# Altium project Tray2.PrjPcb (part 1 of 2)
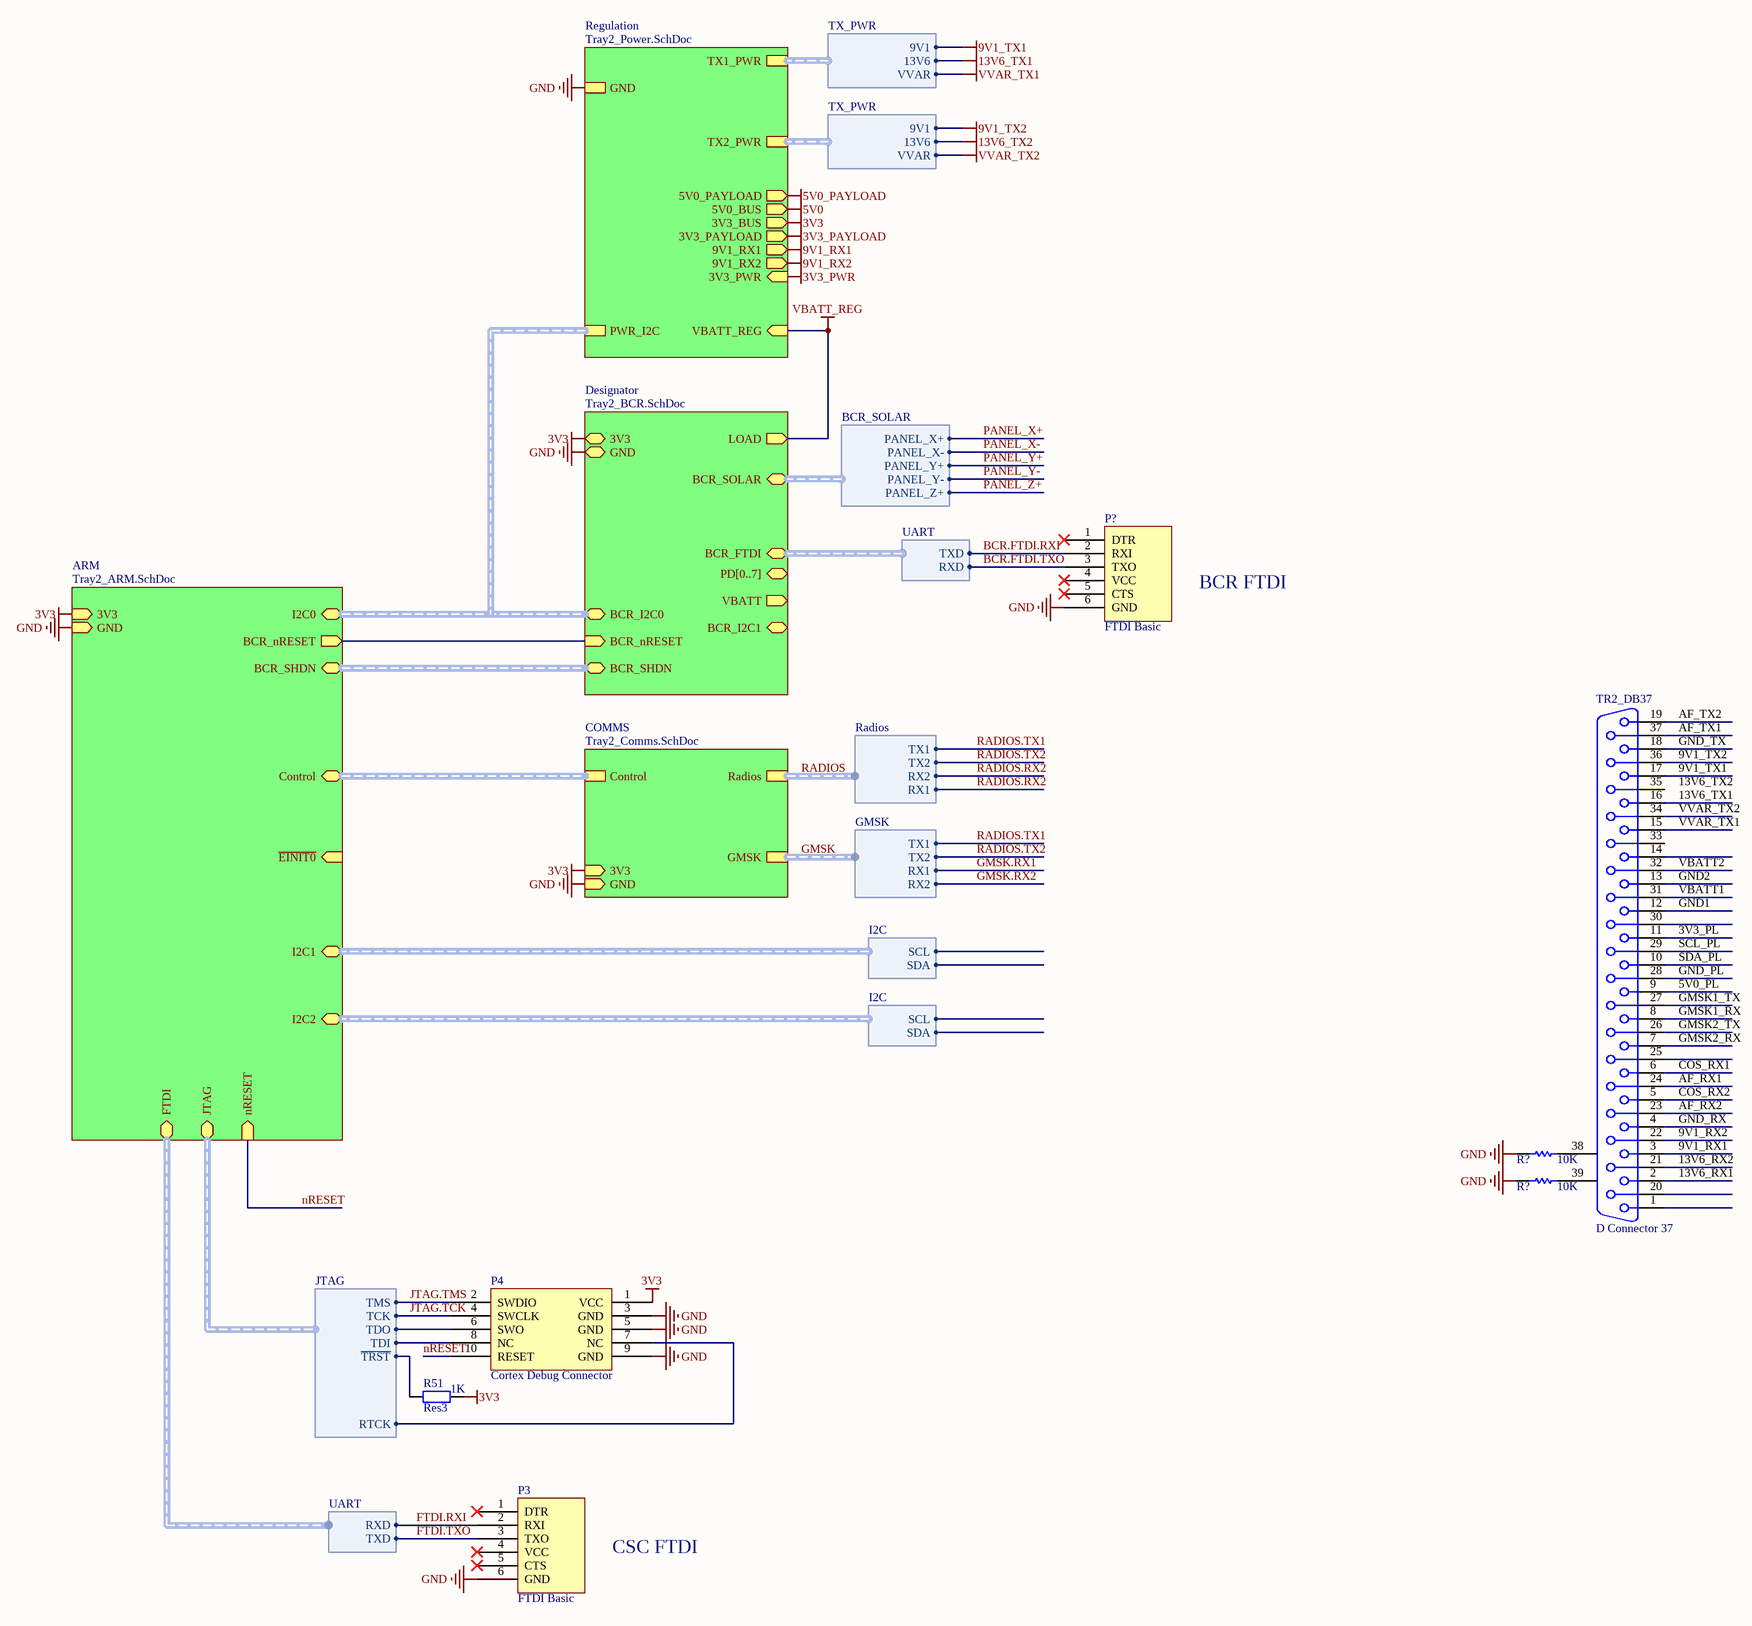
[diagram p0: Tray2_Top.SchDoc]
10 sheets, 509 parts. Net scope: strictly hierarchical (ports join the sheet entries above them; power ports are local).
Board files: Temp_CSC.PcbDoc, Temp_PowerBoard.PcbDoc, Tray2.PcbDoc, Temp_BCR.PcbDoc
Sheets:
  Tray2_Top.SchDoc
    ARM = Tray2_ARM.SchDoc
    Regulation = Tray2_Power.SchDoc
      13V6 = Tray2_Power_RedundantReg.SchDoc
      9V1 = Tray2_Power_RedundantReg.SchDoc
      5V0 = Tray2_Power_RedundantReg.SchDoc
      3V3 = Tray2_Power_RedundantReg.SchDoc
      VVAR = Tray2_Power_RedundantReg.SchDoc
    Designator = Tray2_BCR.SchDoc
      X+ = Tray2_BCR_LT1513.SchDoc
      Y+ = Tray2_BCR_LT1513.SchDoc
      Z+ = Tray2_BCR_LT1513.SchDoc
      X- = Tray2_BCR_LT1513.SchDoc
      Y- = Tray2_BCR_LT1513.SchDoc
    COMMS = Tray2_Comms.SchDoc
      Beacon = Tray2_Comms_Beacon.SchDoc
      SwC = Tray2_Comms_SwC.SchDoc
      AFSK1 = Tray2_Comms_AFSK.SchDoc
      AFSK2 = Tray2_Comms_AFSK.SchDoc

## Sheet Tray2_Top.SchDoc
size A2

### Parts
(Parts that share a designator on the sheet are numbered #1, #2 ... from top to bottom, then left to right.)
P3  FTDI Basic  [FTDI BASIC]
P4  Cortex Debug Connector  [FTSH-105-01-L-DV-TR]
P?  FTDI Basic  [FTDI BASIC]
R51  Res3  value 1K  [RESC1005X06L]
R?#1  value 10K  [RESC2012M]  (hidden comment: Res1)
R?#2  value 10K  [RESC2012M]  (hidden comment: Res1)
TR2_DB37  D Connector 37

### Sub-sheets
ARM = Tray2_ARM.SchDoc: ~{EINIT0} (in), nRESET (in), I2C1 (harness I2C), I2C0 (harness I2C), I2C2 (harness I2C), JTAG (harness JTAG), Control (harness CommsControl), FTDI (harness UART), 3V3 (in), GND (in), BCR_SHDN (harness BCR_SHDN), BCR_nRESET (out)
COMMS = Tray2_Comms.SchDoc: GMSK (harness GMSK), Radios (harness Radios), Control (harness CommsControl), 3V3 (in), GND (in)
Designator = Tray2_BCR.SchDoc: LOAD (out), VBATT (out), 3V3, GND, BCR_nRESET (in), BCR_SOLAR (harness BCR_SOLAR), PD[0..7] (bidir), BCR_I2C0 (harness I2C), BCR_I2C1 (harness I2C), BCR_FTDI (harness UART), BCR_SHDN (harness BCR_SHDN)
Regulation = Tray2_Power.SchDoc: 5V0_BUS (out), 3V3_BUS (out), 5V0_PAYLOAD (out), 3V3_PAYLOAD (out), 9V1_RX1 (out), 9V1_RX2 (out), VBATT_REG (in), GND, 3V3_PWR (in), PWR_I2C (harness I2C), TX1_PWR (harness TX_PWR), TX2_PWR (harness TX_PWR)

### Harnesses
TX_PWR: VVAR, 13V6, 9V1
Radios: RX1, RX2, TX1, TX2
GMSK: RX1, RX2, TX1, TX2
I2C: SCL, SDA
BCR_SOLAR: PANEL_X+, PANEL_X-, PANEL_Y+, PANEL_Y-, PANEL_Z+
JTAG: RTCK, ~{TRST}, TCK, TDI, TDO, TMS
UART: RXD, TXD

### Nets
3V3: P4.1(VCC) R51.2 ; sheet ARM/3V3, sheet Regulation/3V3_BUS, sheet Designator/3V3, sheet COMMS/3V3
9V1_RX1: TR2_DB37.3 ; sheet Regulation/9V1_RX1
9V1_RX2: TR2_DB37.22 ; sheet Regulation/9V1_RX2
9V1_TX1: TR2_DB37.17 ; sheet Regulation/TX1_PWR.9V1
9V1_TX2: TR2_DB37.36 ; sheet Regulation/TX2_PWR.9V1
13V6_TX1: TR2_DB37.16 ; sheet Regulation/TX1_PWR.13V6
GND: P3.6(GND) P4.3(GND) P4.5(GND) P4.9(GND) P?.6(GND) R?#1.1 R?#2.1 ; sheet ARM/GND, sheet Regulation/GND, sheet Designator/GND, sheet COMMS/GND
VBATT_REG: sheet Regulation/VBATT_REG, sheet Designator/LOAD
VVAR_TX1: TR2_DB37.15 ; sheet Regulation/TX1_PWR.VVAR
VVAR_TX2: TR2_DB37.34 ; sheet Regulation/TX2_PWR.VVAR
3V3_PL: TR2_DB37.11
5V0_PL: TR2_DB37.9
13V6_RX1: TR2_DB37.2
13V6_RX2: TR2_DB37.21
AF_RX1: TR2_DB37.24
AF_RX2: TR2_DB37.23
AF_TX1: TR2_DB37.37
AF_TX2: TR2_DB37.19
BCR.FTDI.RXI: P?.2(RXI) ; sheet Designator/BCR_FTDI.TXD
BCR.FTDI.TXO: P?.3(TXO) ; sheet Designator/BCR_FTDI.RXD
BCR_nRESET: sheet ARM/BCR_nRESET, sheet Designator/BCR_nRESET
COS_RX1: TR2_DB37.6
COS_RX2: TR2_DB37.5
FTDI.RXI: P3.2(RXI) ; sheet ARM/FTDI.RXD
FTDI.TXO: P3.3(TXO) ; sheet ARM/FTDI.TXD
GMSK1_RX: TR2_DB37.8
GMSK1_TX: TR2_DB37.27
GMSK2_RX: TR2_DB37.7
GMSK2_TX: TR2_DB37.26
GMSK.RX1: sheet COMMS/GMSK.RX1
GMSK.RX2: sheet COMMS/GMSK.RX2
GND1: TR2_DB37.12
GND2: TR2_DB37.13
GND_PL: TR2_DB37.28
GND_RX: TR2_DB37.4
GND_TX: TR2_DB37.18
JTAG.TCK: P4.4(SWCLK) ; sheet ARM/JTAG.TCK
JTAG.TMS: P4.2(SWDIO) ; sheet ARM/JTAG.TMS
nRESET: P4.10(RESET) ; sheet ARM/nRESET
RADIOS.RX2: sheet COMMS/Radios.RX1, sheet COMMS/Radios.RX2  [project net RADIOS.RX1]
RADIOS.TX1: sheet COMMS/Radios.TX1, sheet COMMS/GMSK.TX1  [project net GMSK.TX1]
RADIOS.TX2: sheet COMMS/Radios.TX2, sheet COMMS/GMSK.TX2  [project net GMSK.TX2]
SCL_PL: TR2_DB37.29
SDA_PL: TR2_DB37.10
VBATT1: TR2_DB37.31
VBATT2: TR2_DB37.32
NetP4_6: P4.6(SWO) ; sheet ARM/JTAG.TDO
NetP4_7: P4.7(NC) ; sheet ARM/JTAG.RTCK
NetP4_8: P4.8(NC) ; sheet ARM/JTAG.TDI
NetR51_1: R51.1 ; sheet ARM/JTAG.~{TRST}
NetR?#1_2: R?#1.2 TR2_DB37.38(MH1)
NetR?#2_2: R?#2.2 TR2_DB37.39(MH2)

Not connected (* = marked no-connect by the designer): P3 1(DTR)* 4(VCC)* 5(CTS)*; P? 1(DTR)* 4(VCC)* 5(CTS)*; TR2_DB37 1 14 20 25 30 33 35

### Buses and harness runs
harness GMSK = sheet COMMS/GMSK
harness RADIOS = sheet COMMS/Radios
harness sheet ARM/BCR_SHDN = sheet Designator/BCR_SHDN
harness sheet ARM/Control = sheet COMMS/Control
harness sheet ARM/I2C0 = sheet Designator/BCR_I2C0 = sheet Regulation/PWR_I2C

### Notes on the sheet
- BCR FTDI
- CSC FTDI
- Labels drawn without touching a wire or pin: 13V6_TX2

### Library data of the parts
P4 = Cortex Debug Connector: Mates with FFSD-05-D-12.00-01-N
R51 = Res3: Resistor; Published: 8-Jun-2000; LatestRevisionDate: 29-May-2009; LatestRevisionNote: IPC-7351 Footprint Added.; PackageReference: J1-0603; Publisher: Altium Limited; PackageDescription: Chip Resistor
R?#1 R?#2 = Res1: Resistor; Published: 8-Jun-2000; LatestRevisionDate: 17-Jul-2002; LatestRevisionNote: Re-released for DXP Platform.; PackageReference: AXIAL-0.3; Publisher: Altium Limited; PackageDescription: Axial Device, Thru-Hole; 2 Leads; 0.3 in Pin Spacing; Supplier 1: Farnell
TR2_DB37 = D Connector 37: Receptacle Assembly, 37 Position, Right Angle; PackageDocument: U; Positions: 25; Published: 15-Jun-2001; LatestRevisionDate: 17-Jul-2002; LatestRevisionNote: Re-released for DXP Platform.; DatasheetDocument: 19-Mar-1999; PackageReference: 787202; Publisher: Altium Limited; Orientation: Right Angle; Gender: Receptacle

## Sheet Tray2_ARM.SchDoc
size A3; PageSetup: Record=PageOptions|CenterHorizontal=True|CenterVertical=True|PrintScale=0.97|XCorrection=1.00|YCorrection=1.00|PrintKind=1|BorderSize=5000000|LeftOffset=0|BottomOffset=0|Orientation=2|PaperLength=2970|PaperWidth=2100|Scale=100|PaperSource=7|PrintQuality=1200|MediaType=1|DitherType=10|PaperKind=A4|PrintScaleMode=1
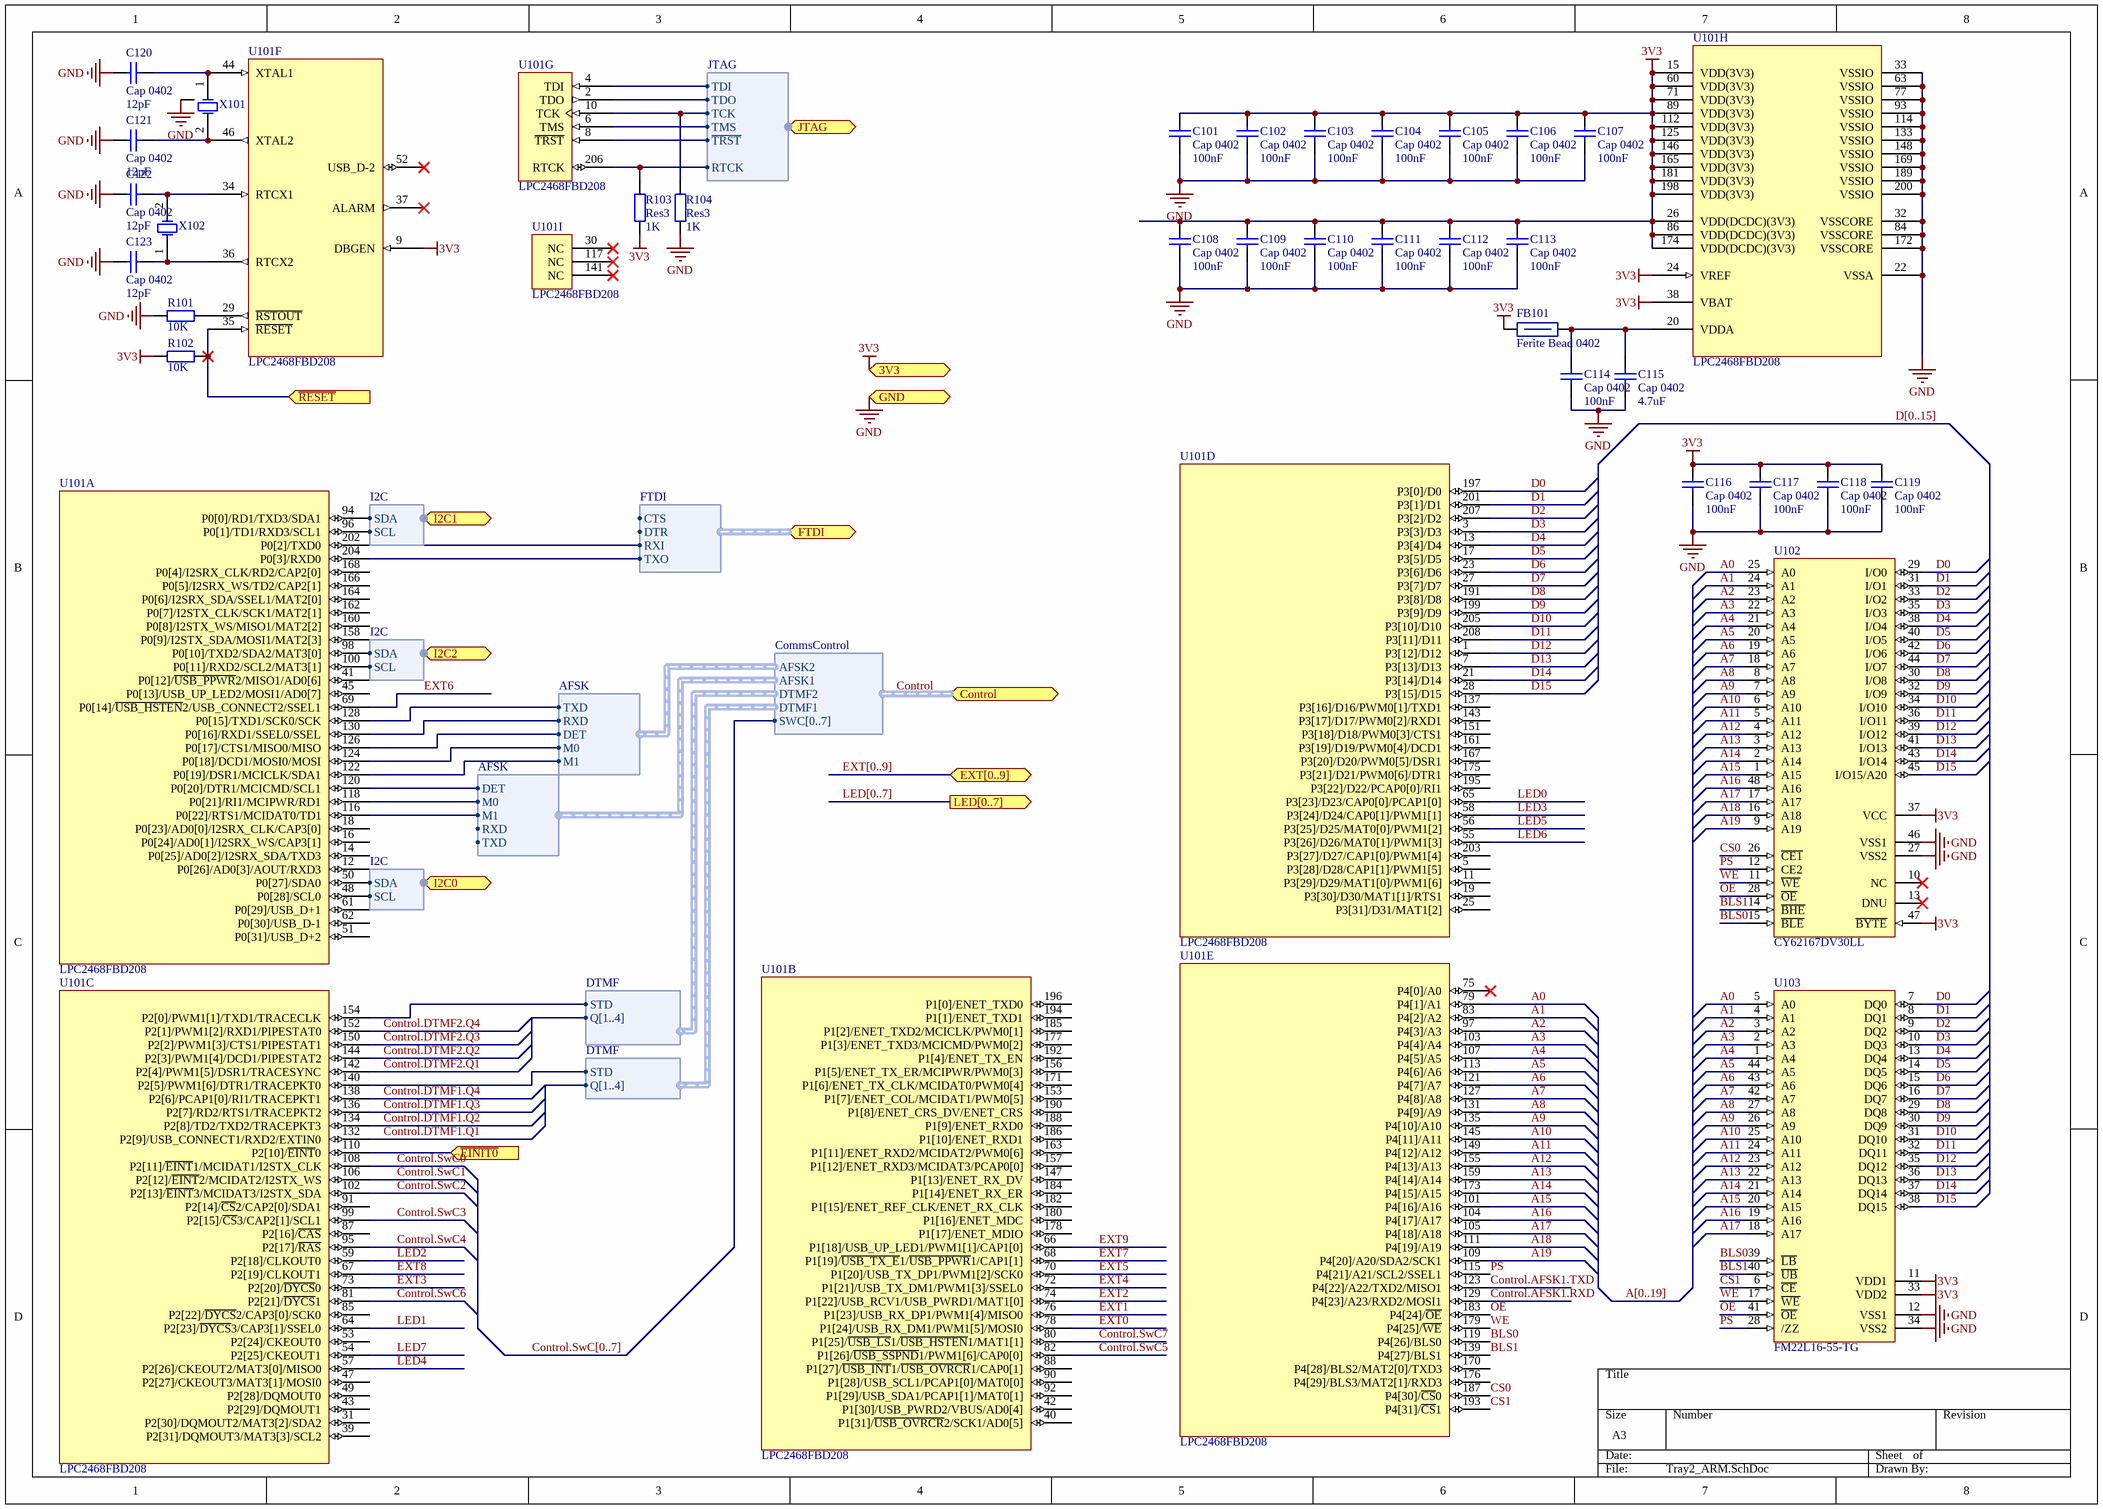
[diagram p1: Tray2_ARM.SchDoc]

### Parts
C101  Cap 0402  value 100nF  [CAPC1005X06L]
C102  Cap 0402  value 100nF  [CAPC1005X06L]
C103  Cap 0402  value 100nF  [CAPC1005X06L]
C104  Cap 0402  value 100nF  [CAPC1005X06L]
C105  Cap 0402  value 100nF  [CAPC1005X06L]
C106  Cap 0402  value 100nF  [CAPC1005X06L]
C107  Cap 0402  value 100nF  [CAPC1005X06L]
C108  Cap 0402  value 100nF  [CAPC1005X06L]
C109  Cap 0402  value 100nF  [CAPC1005X06L]
C110  Cap 0402  value 100nF  [CAPC1005X06L]
C111  Cap 0402  value 100nF  [CAPC1005X06L]
C112  Cap 0402  value 100nF  [CAPC1005X06L]
C113  Cap 0402  value 100nF  [CAPC1005X06L]
C114  Cap 0402  value 100nF  [CAPC1005X06L]
C115  Cap 0402  value 4.7uF  [CAPC1005X06L]
C116  Cap 0402  value 100nF  [CAPC1005X06L]
C117  Cap 0402  value 100nF  [CAPC1005X06L]
C118  Cap 0402  value 100nF  [CAPC1005X06L]
C119  Cap 0402  value 100nF  [CAPC1005X06L]
C120  Cap 0402  value 12pF  [CAPC1005X06L]
C121  Cap 0402  value 12pF  [CAPC1005X06L]
C122  Cap 0402  value 12pF  [CAPC1005X06L]
C123  Cap 0402  value 12pF  [CAPC1005X06L]
FB101  Ferite Bead 0402  [INDC1005X06L]
R101  value 10K  [RESC1005X06L]  (hidden comment: Res3)
R102  value 10K  [RESC1005X06L]  (hidden comment: Res3)
R103  Res3  value 1K  [RESC1005X06L]
R104  Res3  value 1K  [RESC1005X06L]
U101  LPC2468FBD208  [TSQFP50P3000X3000X160-208L]  (parts A,B,C,D,E,F,G,H,I of 9)
U102  CY62167DV30LL  [TSSOP50P2000X120-48L]
U103  FM22L16-55-TG  [TSOP80P1180X120-44L]
X101  Crystal Oscilator  [7M]  (value not drawn)
X102  Crystal Oscilator  [9H T10]  (value not drawn)

### Ports
3V3 (in), Control (harness CommsControl), EXT[0..9] (bidir), FTDI (harness FTDI), GND (in), I2C0 (harness I2C), I2C1 (harness I2C), I2C2 (harness I2C), JTAG (harness JTAG), LED[0..7] (out), ~{EINIT0} (in), ~{RESET} (in)

### Harnesses
I2C: SDA, SCL
JTAG: TDI, TDO, TCK, TMS, ~{TRST}, RTCK
AFSK: DET, M0, M1, RXD, TXD
DTMF: Q[1..4], STD
CommsControl: AFSK1, AFSK2, DTMF1, DTMF2, SWC[0..7]
FTDI: CTS, DTR, RXI, TXO

### Nets
3V3: C101.2 C102.2 C103.2 C104.2 C105.2 C106.2 C107.2 C108.2 C109.2 C110.2 C111.2 C112.2 C113.2 C116.2 C117.2 C118.2 C119.2 FB101.1 R102.2 R103.2 U101.9(DBGEN) U101.15(VDD(3V3)) U101.24(VREF) U101.26(VDD(DCDC)(3V3)) U101.38(VBAT) U101.60(VDD(3V3)) U101.71(VDD(3V3)) U101.86(VDD(DCDC)(3V3)) U101.89(VDD(3V3)) U101.112(VDD(3V3)) U101.125(VDD(3V3)) U101.146(VDD(3V3)) U101.165(VDD(3V3)) U101.174(VDD(DCDC)(3V3)) U101.181(VDD(3V3)) U101.198(VDD(3V3)) U102.37(VCC) U102.47(~{BYTE}) U103.11(VDD1) U103.33(VDD2) ; port 3V3
GND: C101.1 C102.1 C103.1 C104.1 C105.1 C106.1 C107.1 C108.1 C109.1 C110.1 C111.1 C112.1 C113.1 C114.1 C115.1 C116.1 C117.1 C118.1 C119.1 C120.2 C121.1 C122.2 C123.1 R101.2 R104.2 U101.22(VSSA) U101.32(VSSCORE) U101.33(VSSIO) U101.63(VSSIO) U101.77(VSSIO) U101.84(VSSCORE) U101.93(VSSIO) U101.114(VSSIO) U101.133(VSSIO) U101.148(VSSIO) U101.169(VSSIO) U101.172(VSSCORE) U101.189(VSSIO) U101.200(VSSIO) U102.27(VSS2) U102.46(VSS1) U103.12(VSS1) U103.34(VSS2) X101.3 ; port GND
A0: U101.79(P4[1]/A1) U102.25(A0) U103.5(A0)
A1: U101.83(P4[2]/A2) U102.24(A1) U103.4(A1)
A2: U101.97(P4[3]/A3) U102.23(A2) U103.3(A2)
A3: U101.103(P4[4]/A4) U102.22(A3) U103.2(A3)
A4: U101.107(P4[5]/A5) U102.21(A4) U103.1(A4)
A5: U101.113(P4[6]/A6) U102.20(A5) U103.44(A5)
A6: U101.121(P4[7]/A7) U102.19(A6) U103.43(A6)
A7: U101.127(P4[8]/A8) U102.18(A7) U103.42(A7)
A8: U101.131(P4[9]/A9) U102.8(A8) U103.27(A8)
A9: U101.135(P4[10]/A10) U102.7(A9) U103.26(A9)
A10: U101.145(P4[11]/A11) U102.6(A10) U103.25(A10)
A11: U101.149(P4[12]/A12) U102.5(A11) U103.24(A11)
A12: U101.155(P4[13]/A13) U102.4(A12) U103.23(A12)
A13: U101.159(P4[14]/A14) U102.3(A13) U103.22(A13)
A14: U101.173(P4[15]/A15) U102.2(A14) U103.21(A14)
A15: U101.101(P4[16]/A16) U102.1(A15) U103.20(A15)
A16: U101.104(P4[17]/A17) U102.48(A16) U103.19(A16)
A17: U101.105(P4[18]/A18) U102.17(A17) U103.18(A17)
A18: U101.111(P4[19]/A19) U102.16(A18)
A19: U101.109(P4[20]/A20/SDA2/SCK1) U102.9(A19)
BLS0: U101.119(P4[26]/BLS0) U102.15(~{BLE}) U103.39(~{LB})
BLS1: U101.139(P4[27]/BLS1) U102.14(~{BHE}) U103.40(~{UB})
Control.AFSK1.RXD: U101.129(P4[23]/A23/RXD2/MOSI1)
Control.AFSK1.TXD: U101.123(P4[22]/A22/TXD2/MISO1)
Control.DTMF1.Q1: U101.132(P2[9]/USB_CONNECT1/RXD2/EXTIN0)
Control.DTMF1.Q2: U101.134(P2[8]/TD2/TXD2/TRACEPKT3)
Control.DTMF1.Q3: U101.136(P2[7]/RD2/RTS1/TRACEPKT2)
Control.DTMF1.Q4: U101.138(P2[6]/PCAP1[0]/RI1/TRACEPKT1)
Control.DTMF2.Q1: U101.142(P2[4]/PWM1[5]/DSR1/TRACESYNC)
Control.DTMF2.Q2: U101.144(P2[3]/PWM1[4]/DCD1/PIPESTAT2)
Control.DTMF2.Q3: U101.150(P2[2]/PWM1[3]/CTS1/PIPESTAT1)
Control.DTMF2.Q4: U101.152(P2[1]/PWM1[2]/RXD1/PIPESTAT0)
Control.SwC0: U101.108(P2[11]/~{EINT}1/MCIDAT1/I2STX_CLK)
Control.SwC1: U101.106(P2[12]/~{EINT}2/MCIDAT2/I2STX_WS)
Control.SwC2: U101.102(P2[13]/~{EINT}3/MCIDAT3/I2STX_SDA)
Control.SwC3: U101.99(P2[15]/~{CS}3/CAP2[1]/SCL1)
Control.SwC4: U101.95(P2[17]/~{RAS})
Control.SwC5: U101.82(P1[26]/~{USB_SSPND}1/PWM1[6]/CAP0[0])
Control.SwC6: U101.81(P2[21]/~{DYCS}1)
Control.SwC7: U101.80(P1[25]/~{USB_LS}1/~{USB_HSTEN}1/MAT1[1])
CS0: U101.187(P4[30]/~{CS}0) U102.26(~{CE1})
CS1: U101.193(P4[31]/~{CS}1) U103.6(~{CE})
D0: U101.197(P3[0]/D0) U102.29(I/O0) U103.7(DQ0)
D1: U101.201(P3[1]/D1) U102.31(I/O1) U103.8(DQ1)
D2: U101.207(P3[2]/D2) U102.33(I/O2) U103.9(DQ2)
D3: U101.3(P3[3]/D3) U102.35(I/O3) U103.10(DQ3)
D4: U101.13(P3[4]/D4) U102.38(I/O4) U103.13(DQ4)
D5: U101.17(P3[5]/D5) U102.40(I/O5) U103.14(DQ5)
D6: U101.23(P3[6]/D6) U102.42(I/O6) U103.15(DQ6)
D7: U101.27(P3[7]/D7) U102.44(I/O7) U103.16(DQ7)
D8: U101.191(P3[8]/D8) U102.30(I/O8) U103.29(DQ8)
D9: U101.199(P3[9]/D9) U102.32(I/O9) U103.30(DQ9)
D10: U101.205(P3[10]/D10) U102.34(I/O10) U103.31(DQ10)
D11: U101.208(P3[11]/D11) U102.36(I/O11) U103.32(DQ11)
D12: U101.1(P3[12]/D12) U102.39(I/O12) U103.35(DQ12)
D13: U101.7(P3[13]/D13) U102.41(I/O13) U103.36(DQ13)
D14: U101.21(P3[14]/D14) U102.43(I/O14) U103.37(DQ14)
D15: U101.28(P3[15]/D15) U102.45(I/O15/A20) U103.38(DQ15)
EXT0: U101.78(P1[24]/USB_RX_DM1/PWM1[5]/MOSI0)
EXT1: U101.76(P1[23]/USB_RX_DP1/PWM1[4]/MISO0)
EXT2: U101.74(P1[22]/USB_RCV1/USB_PWRD1/MAT1[0])
EXT3: U101.73(P2[20]/~{DYCS}0)
EXT4: U101.72(P1[21]/USB_TX_DM1/PWM1[3]/SSEL0)
EXT5: U101.70(P1[20]/USB_TX_DP1/PWM1[2]/SCK0)
EXT6: U101.69(P0[14]/~{USB_HSTEN}2/USB_CONNECT2/SSEL1)
EXT7: U101.68(P1[19]/~{USB_TX_E}1/~{USB_PPWR}1/CAP1[1])
EXT8: U101.67(P2[19]/CLKOUT1)
EXT9: U101.66(P1[18]/USB_UP_LED1/PWM1[1]/CAP1[0])
JTAG.TCK: R104.1 U101.10(TCK) ; port JTAG.TCK
JTAG.TMS: U101.6(TMS) ; port JTAG.TMS
LED0: U101.65(P3[23]/D23/CAP0[0]/PCAP1[0])
LED1: U101.64(P2[23]/~{DYCS}3/CAP3[1]/SSEL0)
LED2: U101.59(P2[18]/CLKOUT0)
LED3: U101.58(P3[24]/D24/CAP0[1]/PWM1[1])
LED4: U101.57(P2[26]/CKEOUT2/MAT3[0]/MISO0)
LED5: U101.56(P3[25]/D25/MAT0[0]/PWM1[2])
LED6: U101.55(P3[26]/D26/MAT0[1]/PWM1[3])
LED7: U101.54(P2[25]/CKEOUT1)
OE: U101.183(P4[24]/~{OE}) U102.28(~{OE}) U103.41(~{OE})
PS: U101.115(P4[21]/A21/SCL2/SSEL1) U102.12(CE2) U103.28(/ZZ)
SCL: U101.48(P0[28]/SCL0) ; port I2C0.SCL
SDA: U101.50(P0[27]/SDA0) ; port I2C0.SDA
WE: U101.179(P4[25]/~{WE}) U102.11(~{WE}) U103.17(~{WE})
NetC114_2: C114.2 C115.2 FB101.2 U101.20(VDDA)
NetC120_1: C120.1 U101.44(XTAL1) X101.1(OSC1)
NetC121_2: C121.2 U101.46(XTAL2) X101.2(OSC2)
NetC122_1: C122.1 U101.34(RTCX1) X102.2(OSC2)
NetC123_2: C123.2 U101.36(RTCX2) X102.1(OSC1)
NetP4_6: U101.2(TDO) ; port JTAG.TDO
NetP4_7: R103.1 U101.206(RTCK) ; port JTAG.RTCK
NetP4_8: U101.4(TDI) ; port JTAG.TDI
NetR51_1: U101.8(~{TRST}) ; port JTAG.~{TRST}
NetR101_1: R101.1 U101.29(~{RSTOUT})
NetR102_1: R102.1 U101.35(~{RESET}) ; port ~{RESET}
NetU101_94: U101.94(P0[0]/RD1/TXD3/SDA1) ; port I2C1.SDA
NetU101_96: U101.96(P0[1]/TD1/RXD3/SCL1) ; port I2C1.SCL
NetU101_98: U101.98(P0[10]/TXD2/SDA2/MAT3[0]) ; port I2C2.SDA
NetU101_100: U101.100(P0[11]/RXD2/SCL2/MAT3[1]) ; port I2C2.SCL
NetU101_110: U101.110(P2[10]/~{EINT}0) ; port ~{EINIT0}
NetU101_116: U101.116(P0[22]/RTS1/MCIDAT0/TD1) ; harness AFSK.M1
NetU101_118: U101.118(P0[21]/RI1/MCIPWR/RD1) ; harness AFSK.M0
NetU101_120: U101.120(P0[20]/DTR1/MCICMD/SCL1) ; harness AFSK.DET
NetU101_122: U101.122(P0[19]/DSR1/MCICLK/SDA1) ; harness AFSK.M1
NetU101_124: U101.124(P0[18]/DCD1/MOSI0/MOSI) ; harness AFSK.M0
NetU101_126: U101.126(P0[17]/CTS1/MISO0/MISO) ; harness AFSK.DET
NetU101_128: U101.128(P0[15]/TXD1/SCK0/SCK) ; harness AFSK.TXD
NetU101_130: U101.130(P0[16]/RXD1/SSEL0/SSEL) ; harness AFSK.RXD
NetU101_140: U101.140(P2[5]/PWM1[6]/DTR1/TRACEPKT0) ; harness DTMF.STD
NetU101_154: U101.154(P2[0]/PWM1[1]/TXD1/TRACECLK) ; harness DTMF.STD
NetU101_202: U101.202(P0[2]/TXD0) ; port FTDI.RXI
NetU101_204: U101.204(P0[3]/RXD0) ; port FTDI.TXO

Not connected (* = marked no-connect by the designer): U101 5(P3[28]/D28/CAP1[1]/PWM1[5]) 11(P3[29]/D29/MAT1[0]/PWM1[6]) 12(P0[26]/AD0[3]/AOUT/RXD3) 14(P0[25]/AD0[2]/I2SRX_SDA/TXD3) 16(P0[24]/AD0[1]/I2SRX_WS/CAP3[1]) 18(P0[23]/AD0[0]/I2SRX_CLK/CAP3[0]) 19(P3[30]/D30/MAT1[1]/RTS1) 25(P3[31]/D31/MAT1[2]) 30(NC)* 31(P2[30]/DQMOUT2/MAT3[2]/SDA2) 37(ALARM)* 39(P2[31]/DQMOUT3/MAT3[3]/SCL2) 40(P1[31]/~{USB_OVRCR}2/SCK1/AD0[5]) 41(P0[12]/~{USB_PPWR}2/MISO1/AD0[6]) 42(P1[30]/USB_PWRD2/VBUS/AD0[4]) 43(P2[29]/DQMOUT1) 45(P0[13]/USB_UP_LED2/MOSI1/AD0[7]) 47(P2[27]/CKEOUT3/MAT3[1]/MOSI0) 49(P2[28]/DQMOUT0) 51(P0[31]/USB_D+2) 52(USB_D-2)* 53(P2[24]/CKEOUT0) 61(P0[29]/USB_D+1) 62(P0[30]/USB_D-1) 75(P4[0]/A0)* 85(P2[22]/~{DYCS}2/CAP3[0]/SCK0) 87(P2[16]/~{CAS}) 88(P1[27]/~{USB_INT}1/~{USB_OVRCR}1/CAP0[1]) 90(P1[28]/USB_SCL1/PCAP1[0]/MAT0[0]) 91(P2[14]/~{CS}2/CAP2[0]/SDA1) 92(P1[29]/USB_SDA1/PCAP1[1]/MAT0[1]) 117(NC)* 137(P3[16]/D16/PWM0[1]/TXD1) 141(NC)* 143(P3[17]/D17/PWM0[2]/RXD1) 147(P1[13]/ENET_RX_DV) 151(P3[18]/D18/PWM0[3]/CTS1) 153(P1[7]/ENET_COL/MCIDAT1/PWM0[5]) 156(P1[5]/ENET_TX_ER/MCIPWR/PWM0[3]) 157(P1[12]/ENET_RXD3/MCIDAT3/PCAP0[0]) 158(P0[9]/I2STX_SDA/MOSI1/MAT2[3]) 160(P0[8]/I2STX_WS/MISO1/MAT2[2]) 161(P3[19]/D19/PWM0[4]/DCD1) 162(P0[7]/I2STX_CLK/SCK1/MAT2[1]) 163(P1[11]/ENET_RXD2/MCIDAT2/PWM0[6]) 164(P0[6]/I2SRX_SDA/SSEL1/MAT2[0]) 166(P0[5]/I2SRX_WS/TD2/CAP2[1]) 167(P3[20]/D20/PWM0[5]/DSR1) 168(P0[4]/I2SRX_CLK/RD2/CAP2[0]) 170(P4[28]/BLS2/MAT2[0]/TXD3) 171(P1[6]/ENET_TX_CLK/MCIDAT0/PWM0[4]) 175(P3[21]/D21/PWM0[6]/DTR1) 176(P4[29]/BLS3/MAT2[1]/RXD3) 177(P1[3]/ENET_TXD3/MCICMD/PWM0[2]) 178(P1[17]/ENET_MDIO) 180(P1[16]/ENET_MDC) 182(P1[15]/ENET_REF_CLK/ENET_RX_CLK) 184(P1[14]/ENET_RX_ER) 185(P1[2]/ENET_TXD2/MCICLK/PWM0[1]) 186(P1[10]/ENET_RXD1) 188(P1[9]/ENET_RXD0) 190(P1[8]/ENET_CRS_DV/ENET_CRS) 192(P1[4]/ENET_TX_EN) 194(P1[1]/ENET_TXD1) 195(P3[22]/D22/PCAP0[0]/RI1) 196(P1[0]/ENET_TXD0) 203(P3[27]/D27/CAP1[0]/PWM1[4]); U102 10(NC)* 13(DNU)*

### Buses and harness runs
bus A[0..19]
bus Control.SwC[0..7]
bus D[0..15]
bus EXT[0..9] = port EXT[0..9]
bus LED[0..7] = port LED[0..7]
harness Control = port Control

### Library data of the parts
C101-C123 = Cap 0402: Capacitor; Published: 8-Jun-2000; LatestRevisionDate: 17-Jul-2002; LatestRevisionNote: Re-released for DXP Platform.; PackageReference: RAD-0.3; Publisher: Altium Limited; PackageDescription: Radial Cap, Thru-Hole; 2 Leads; 0.3 in Pin Spacing
FB101 = FB_0402: Ferite Bead : 0402; Published: 8-Jun-2000; LatestRevisionDate: 29-May-2009; LatestRevisionNote: IPC-7351 Footprint Added.; PackageReference: J1-0603; Publisher: Altium Limited; PackageDescription: Chip Resistor
R101-R104 = Res3: Resistor; Published: 8-Jun-2000; LatestRevisionDate: 29-May-2009; LatestRevisionNote: IPC-7351 Footprint Added.; PackageReference: J1-0603; Publisher: Altium Limited; PackageDescription: Chip Resistor
U101 = LPC2468FBD208: ARM7 16/32-Bit Microcontroller, 512KB Flash, 98KB RAM, 208-Lead LQFP; Code_IEC: 136E30; Published: 17-Aug-2007; DatasheetVersion: rev.01, Jul-2007; PackageVersion: Feb-2003; PackageReference: SOT459-1; Publisher: Altium Limited; PackageDescription: 208-Pin Plastic Low Profile Quad Flat Pack, LQFP208; Code_JEDEC: MS-026; ComponentLink1Description: Manufacturer Link; ComponentLink1URL: http://www.nxp.com/; ComponentLink2Description: Datasheet; ComponentLink2URL: http://www.standardics.nxp.com/products/lpc2000/datasheet/lpc2468.pdf
U102 = CY62167DV30LL: 16-Mbit (1M x 16) Static RAM; ColumnAddress: A0-A9; Publisher: Altium Limited; ComponentLink1Description: Manufacturer Link; ComponentLink2Description: Datasheet
U103 = FM22L16-55-TG: FRAM, 2MB, 3V, 60NS, 44TSOP2; ColumnAddress: A0-A9; LatestRevisionDate: 13-Apr-2006; DatasheetVersion: rev1.1, Feb-2004; PackageReference: TSOP2-44_M; PackageDescription: 44-Pin Small Outline Package 0.8 mm Pitch; ComponentLink1Description: Manufacturer Link; ComponentLink2Description: Datasheet
X101 = C.O. 4pins: Crystal Oscillator; Value: 12.000MHz; Published: 8-Jun-2000; LatestRevisionDate: 17-Jul-2002; LatestRevisionNote: Re-released for DXP Platform.; PackageReference: R38; Publisher: Altium Limited
X102 = C.O. 2pins: Crystal Oscillator; Value: 12.000MHz; Published: 8-Jun-2000; LatestRevisionDate: 17-Jul-2002; LatestRevisionNote: Re-released for DXP Platform.; PackageReference: R38; Publisher: Altium Limited

## Sheet Tray2_Power.SchDoc
size A3
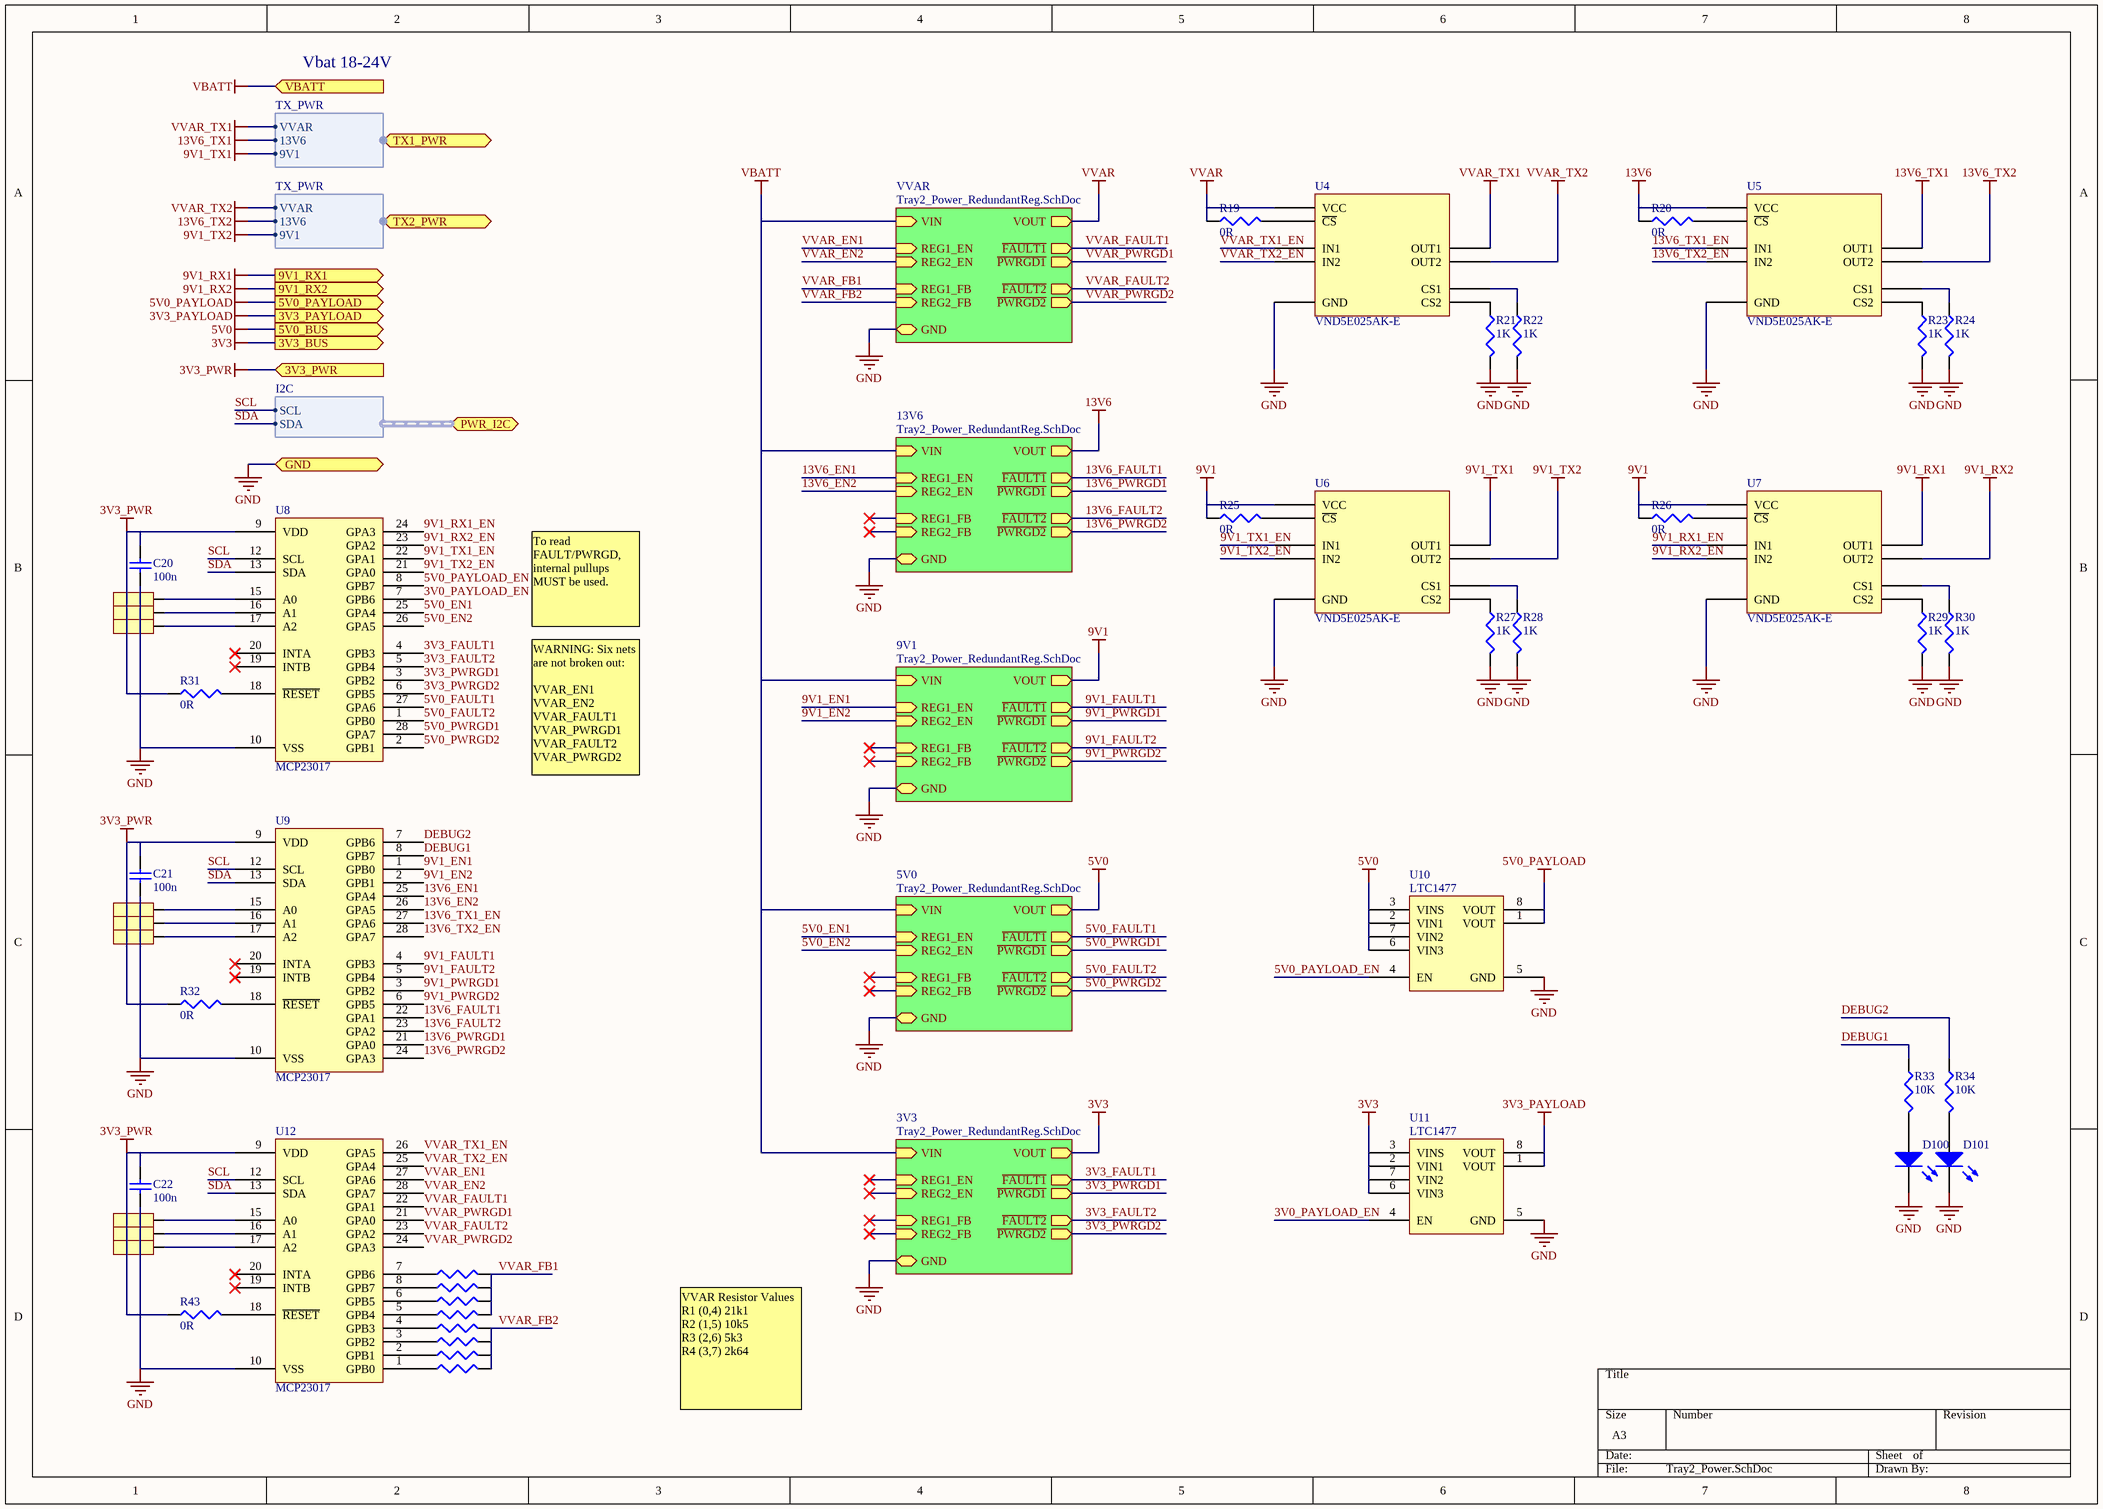
[diagram p2: Tray2_Power.SchDoc]

### Parts
C20  value 100n  [R0805M]
C21  value 100n  [R0805M]
C22  value 100n  [R0805M]
D100  LED0  [R0805M]  (value not drawn)
D101  LED0  [R0805M]  (value not drawn)
J1  3-WAY JUMPER  [J1205M]  (value not drawn)
J2  3-WAY JUMPER  [J1205M]  (value not drawn)
J3  3-WAY JUMPER  [J1205M]  (value not drawn)
J4  3-WAY JUMPER  [J1205M]  (value not drawn)
J5  3-WAY JUMPER  [J1205M]  (value not drawn)
J6  3-WAY JUMPER  [J1205M]  (value not drawn)
J7  3-WAY JUMPER  [J1205M]  (value not drawn)
J8  3-WAY JUMPER  [J1205M]  (value not drawn)
J9  3-WAY JUMPER  [J1205M]  (value not drawn)
R19  value 0R  [R0402M]
R20  value 0R  [R0402M]
R21  value 1K  [R0402M]
R22  value 1K  [R0402M]
R23  value 1K  [R0402M]
R24  value 1K  [R0402M]
R25  value 0R  [R0402M]
R26  value 0R  [R0402M]
R27  value 1K  [R0402M]
R28  value 1K  [R0402M]
R29  value 1K  [R0402M]
R30  value 1K  [R0402M]
R31  value 0R  [R0402M]
R32  value 0R  [R0402M]
R33  value 10K  [R0402M]
R34  value 10K  [R0402M]
R35  VSET_1  [R0805M]  (value not drawn)
R36  VSET_1  [R0805M]  (value not drawn)
R37  VSET_1  [R0805M]  (value not drawn)
R38  VSET_1  [R0805M]  (value not drawn)
R39  VSET_1  [R0805M]  (value not drawn)
R40  VSET_1  [R0805M]  (value not drawn)
R41  VSET_1  [R0805M]  (value not drawn)
R42  VSET_1  [R0805M]  (value not drawn)
R43  value 0R  [R0402M]
U4  VND5E025AK-E  [SSO24]
U5  VND5E025AK-E  [SSO24]
U6  VND5E025AK-E  [SSO24]
U7  VND5E025AK-E  [SSO24]
U8  MCP23017  [SSOP28]
U9  MCP23017  [SSOP28]
U10  LTC1477  [SO8]
U11  LTC1477  [SO8]
U12  MCP23017  [SSOP28]

### Sub-sheets
3V3 = Tray2_Power_RedundantReg.SchDoc: REG1_EN (in), REG2_EN (in), VIN (in), VOUT (out), REG1_FB (in), REG2_FB (in), GND, ~{FAULT1} (out), ~{FAULT2} (out), ~{PWRGD1} (out), ~{PWRGD2} (out)
5V0 = Tray2_Power_RedundantReg.SchDoc: REG1_EN (in), REG2_EN (in), VIN (in), VOUT (out), REG1_FB (in), REG2_FB (in), GND, ~{FAULT1} (out), ~{FAULT2} (out), ~{PWRGD1} (out), ~{PWRGD2} (out)
9V1 = Tray2_Power_RedundantReg.SchDoc: REG1_EN (in), REG2_EN (in), VIN (in), VOUT (out), REG1_FB (in), REG2_FB (in), GND, ~{FAULT1} (out), ~{FAULT2} (out), ~{PWRGD1} (out), ~{PWRGD2} (out)
13V6 = Tray2_Power_RedundantReg.SchDoc: REG1_EN (in), REG2_EN (in), VIN (in), VOUT (out), REG1_FB (in), REG2_FB (in), GND, ~{FAULT1} (out), ~{FAULT2} (out), ~{PWRGD1} (out), ~{PWRGD2} (out)
VVAR = Tray2_Power_RedundantReg.SchDoc: REG1_EN (in), REG2_EN (in), VIN (in), VOUT (out), REG1_FB (in), REG2_FB (in), GND, ~{FAULT1} (out), ~{FAULT2} (out), ~{PWRGD1} (out), ~{PWRGD2} (out)

### Ports
3V3_BUS (out), 3V3_PAYLOAD (out), 3V3_PWR (in), 5V0_BUS (out), 5V0_PAYLOAD (out), 9V1_RX1 (out), 9V1_RX2 (out), GND, PWR_I2C (harness I2C), TX1_PWR (harness TX_PWR), TX2_PWR (harness TX_PWR), VBATT (in)

### Harnesses
I2C: SCL, SDA
TX_PWR: VVAR, 13V6, 9V1

### Nets
3V3: U11.2(VIN1) U11.3(VINS) U11.6(VIN3) U11.7(VIN2) ; port 3V3_BUS, sheet 3V3/VOUT
3V3_PAYLOAD: U11.1(VOUT) U11.8(VOUT) ; port 3V3_PAYLOAD
3V3_PWR: C20.1 C21.1 C22.1 J1.1 J2.1 J3.1 J4.1 J5.1 J6.1 J7.1 J8.1 J9.1 R31.1 R32.1 R43.1 U8.9(VDD) U9.9(VDD) U12.9(VDD) ; port 3V3_PWR
5V0: U10.2(VIN1) U10.3(VINS) U10.6(VIN3) U10.7(VIN2) ; port 5V0_BUS, sheet 5V0/VOUT
5V0_PAYLOAD: U10.1(VOUT) U10.8(VOUT) ; port 5V0_PAYLOAD
9V1: R25.1 R26.1 U6.VCC U7.VCC ; sheet 9V1/VOUT
9V1_RX1: U7.OUT1 ; port 9V1_RX1
9V1_RX2: U7.OUT2 ; port 9V1_RX2
9V1_TX1: U6.OUT1 ; port TX1_PWR.9V1
9V1_TX2: U6.OUT2 ; port TX2_PWR.9V1
13V6: R20.1 U5.VCC ; sheet 13V6/VOUT
13V6_TX1: U5.OUT1 ; port TX1_PWR.13V6
13V6_TX2: U5.OUT2 ; port TX2_PWR.13V6
GND: C20.2 C21.2 C22.2 D100.2(K) D101.2(K) J1.3 J2.3 J3.3 J4.3 J5.3 J6.3 J7.3 J8.3 J9.3 R21.2 R22.2 R23.2 R24.2 R27.2 R28.2 R29.2 R30.2 U4.GND U5.GND U6.GND U7.GND U8.10(VSS) U9.10(VSS) U10.5(GND) U11.5(GND) U12.10(VSS) ; port GND, sheet 13V6/GND, sheet 9V1/GND, sheet 5V0/GND, sheet 3V3/GND, sheet VVAR/GND
VBATT: port VBATT, sheet 13V6/VIN, sheet 9V1/VIN, sheet 5V0/VIN, sheet 3V3/VIN, sheet VVAR/VIN
VVAR: R19.1 U4.VCC ; sheet VVAR/VOUT
VVAR_TX1: U4.OUT1 ; port TX1_PWR.VVAR
VVAR_TX2: U4.OUT2 ; port TX2_PWR.VVAR
3V0_PAYLOAD_EN: U8.7(GPB6) U11.4(EN)
3V3_FAULT1: U8.4(GPB3) ; sheet 3V3/~{FAULT1}
3V3_FAULT2: U8.5(GPB4) ; sheet 3V3/~{FAULT2}
3V3_PWRGD1: U8.3(GPB2) ; sheet 3V3/~{PWRGD1}
3V3_PWRGD2: U8.6(GPB5) ; sheet 3V3/~{PWRGD2}
5V0_EN1: U8.25(GPA4) ; sheet 5V0/REG1_EN
5V0_EN2: U8.26(GPA5) ; sheet 5V0/REG2_EN
5V0_FAULT1: U8.27(GPA6) ; sheet 5V0/~{FAULT1}
5V0_FAULT2: U8.1(GPB0) ; sheet 5V0/~{FAULT2}
5V0_PAYLOAD_EN: U8.8(GPB7) U10.4(EN)
5V0_PWRGD1: U8.28(GPA7) ; sheet 5V0/~{PWRGD1}
5V0_PWRGD2: U8.2(GPB1) ; sheet 5V0/~{PWRGD2}
9V1_EN1: U9.1(GPB0) ; sheet 9V1/REG1_EN
9V1_EN2: U9.2(GPB1) ; sheet 9V1/REG2_EN
9V1_FAULT1: U9.4(GPB3) ; sheet 9V1/~{FAULT1}
9V1_FAULT2: U9.5(GPB4) ; sheet 9V1/~{FAULT2}
9V1_PWRGD1: U9.3(GPB2) ; sheet 9V1/~{PWRGD1}
9V1_PWRGD2: U9.6(GPB5) ; sheet 9V1/~{PWRGD2}
9V1_RX1_EN: U7.IN1 U8.24(GPA3)
9V1_RX2_EN: U7.IN2 U8.23(GPA2)
9V1_TX1_EN: U6.IN1 U8.22(GPA1)
9V1_TX2_EN: U6.IN2 U8.21(GPA0)
13V6_EN1: U9.25(GPA4) ; sheet 13V6/REG1_EN
13V6_EN2: U9.26(GPA5) ; sheet 13V6/REG2_EN
13V6_FAULT1: U9.22(GPA1) ; sheet 13V6/~{FAULT1}
13V6_FAULT2: U9.23(GPA2) ; sheet 13V6/~{FAULT2}
13V6_PWRGD1: U9.21(GPA0) ; sheet 13V6/~{PWRGD1}
13V6_PWRGD2: U9.24(GPA3) ; sheet 13V6/~{PWRGD2}
13V6_TX1_EN: U5.IN1 U9.27(GPA6)
13V6_TX2_EN: U5.IN2 U9.28(GPA7)
DEBUG1: R33.1 U9.8(GPB7)
DEBUG2: R34.1 U9.7(GPB6)
SCL: U8.12(SCL) U9.12(SCL) U12.12(SCL) ; port PWR_I2C.SCL
SDA: U8.13(SDA) U9.13(SDA) U12.13(SDA) ; port PWR_I2C.SDA
VVAR_EN1: U12.27(GPA6) ; sheet VVAR/REG1_EN
VVAR_EN2: U12.28(GPA7) ; sheet VVAR/REG2_EN
VVAR_FAULT1: U12.22(GPA1) ; sheet VVAR/~{FAULT1}
VVAR_FAULT2: U12.23(GPA2) ; sheet VVAR/~{FAULT2}
VVAR_FB1: R35.2 R36.2 R37.2 R38.2 ; sheet VVAR/REG1_FB
VVAR_FB2: R39.2 R40.2 R41.2 R42.2 ; sheet VVAR/REG2_FB
VVAR_PWRGD1: U12.21(GPA0) ; sheet VVAR/~{PWRGD1}
VVAR_PWRGD2: U12.24(GPA3) ; sheet VVAR/~{PWRGD2}
VVAR_TX1_EN: U4.IN1 U12.26(GPA5)
VVAR_TX2_EN: U4.IN2 U12.25(GPA4)
NetD100_1: D100.1(A) R33.2
NetD101_1: D101.1(A) R34.2
NetJ1_2: J1.2 U8.15(A0)
NetJ2_2: J2.2 U8.16(A1)
NetJ3_2: J3.2 U8.17(A2)
NetJ4_2: J4.2 U9.15(A0)
NetJ5_2: J5.2 U9.16(A1)
NetJ6_2: J6.2 U9.17(A2)
NetJ7_2: J7.2 U12.15(A0)
NetJ8_2: J8.2 U12.16(A1)
NetJ9_2: J9.2 U12.17(A2)
NetR19_2: R19.2 U4.CS_DIS(~{CS})
NetR20_2: R20.2 U5.CS_DIS(~{CS})
NetR21_1: R21.1 U4.CS2
NetR22_1: R22.1 U4.CS1
NetR23_1: R23.1 U5.CS2
NetR24_1: R24.1 U5.CS1
NetR25_2: R25.2 U6.CS_DIS(~{CS})
NetR26_2: R26.2 U7.CS_DIS(~{CS})
NetR27_1: R27.1 U6.CS2
NetR28_1: R28.1 U6.CS1
NetR29_1: R29.1 U7.CS2
NetR30_1: R30.1 U7.CS1
NetR31_2: R31.2 U8.18(~{RESET})
NetR32_2: R32.2 U9.18(~{RESET})
NetR35_1: R35.1 U12.7(GPB6)
NetR36_1: R36.1 U12.8(GPB7)
NetR37_1: R37.1 U12.6(GPB5)
NetR38_1: R38.1 U12.5(GPB4)
NetR39_1: R39.1 U12.4(GPB3)
NetR40_1: R40.1 U12.3(GPB2)
NetR41_1: R41.1 U12.2(GPB1)
NetR42_1: R42.1 U12.1(GPB0)
NetR43_2: R43.2 U12.18(~{RESET})

Not connected (* = marked no-connect by the designer): U8 19(INTB)* 20(INTA)*; U9 19(INTB)* 20(INTA)*; U12 19(INTB)* 20(INTA)*

### Notes on the sheet
- Vbat 18-24V
- To read FAULT/PWRGD, internal pullups MUST be used.
- WARNING: Six nets are not broken out:
  VVAR_EN1
  VVAR_EN2
  VVAR_FAULT1
  VVAR_PWRGD1
  VVAR_FAULT2
  VVAR_PWRGD2
- VVAR Resistor Values
  R1 (0,4)	21k1
  R2 (1,5)	10k5
  R3 (2,6)	5k3
  R4 (3,7)	2k64

### Library data of the parts
C20-C22 = Cap: Capacitor; Published: 8-Jun-2000; LatestRevisionDate: 17-Jul-2002; LatestRevisionNote: Re-released for DXP Platform.; PackageReference: RAD-0.3; Publisher: Altium Limited; PackageDescription: Radial Cap, Thru-Hole; 2 Leads; 0.3 in Pin Spacing
D100 D101 = LED0: Typical INFRARED GaAs LED; Published: 8-Jun-2000; LatestRevisionDate: 08-Jul-2005; LatestRevisionNote: Mech Layer 1 removed.; PackageReference: LED-0; Publisher: Altium Limited; PackageDescription: LED; 2 Leads
R19-R43 = Res3: Resistor; Published: 8-Jun-2000; LatestRevisionDate: 29-May-2009; LatestRevisionNote: IPC-7351 Footprint Added.; PackageReference: J1-0603; Publisher: Altium Limited; PackageDescription: Chip Resistor
U4-U7 = VND5E025AK-E: Double channel high-side driver with analog current sense
U8 U9 U12 = MCP23017: 16-Bit I/O Expander with Serial Interface
U10 U11 = LTC1477: Single Protected High Side Switches

## Sheet Tray2_Power_RedundantReg.SchDoc
size A4
Used 5 times, as channels Regulation/13V6, Regulation/9V1, Regulation/5V0, Regulation/3V3, Regulation/VVAR. Parts and nets are listed once, with the designators drawn on the sheet.
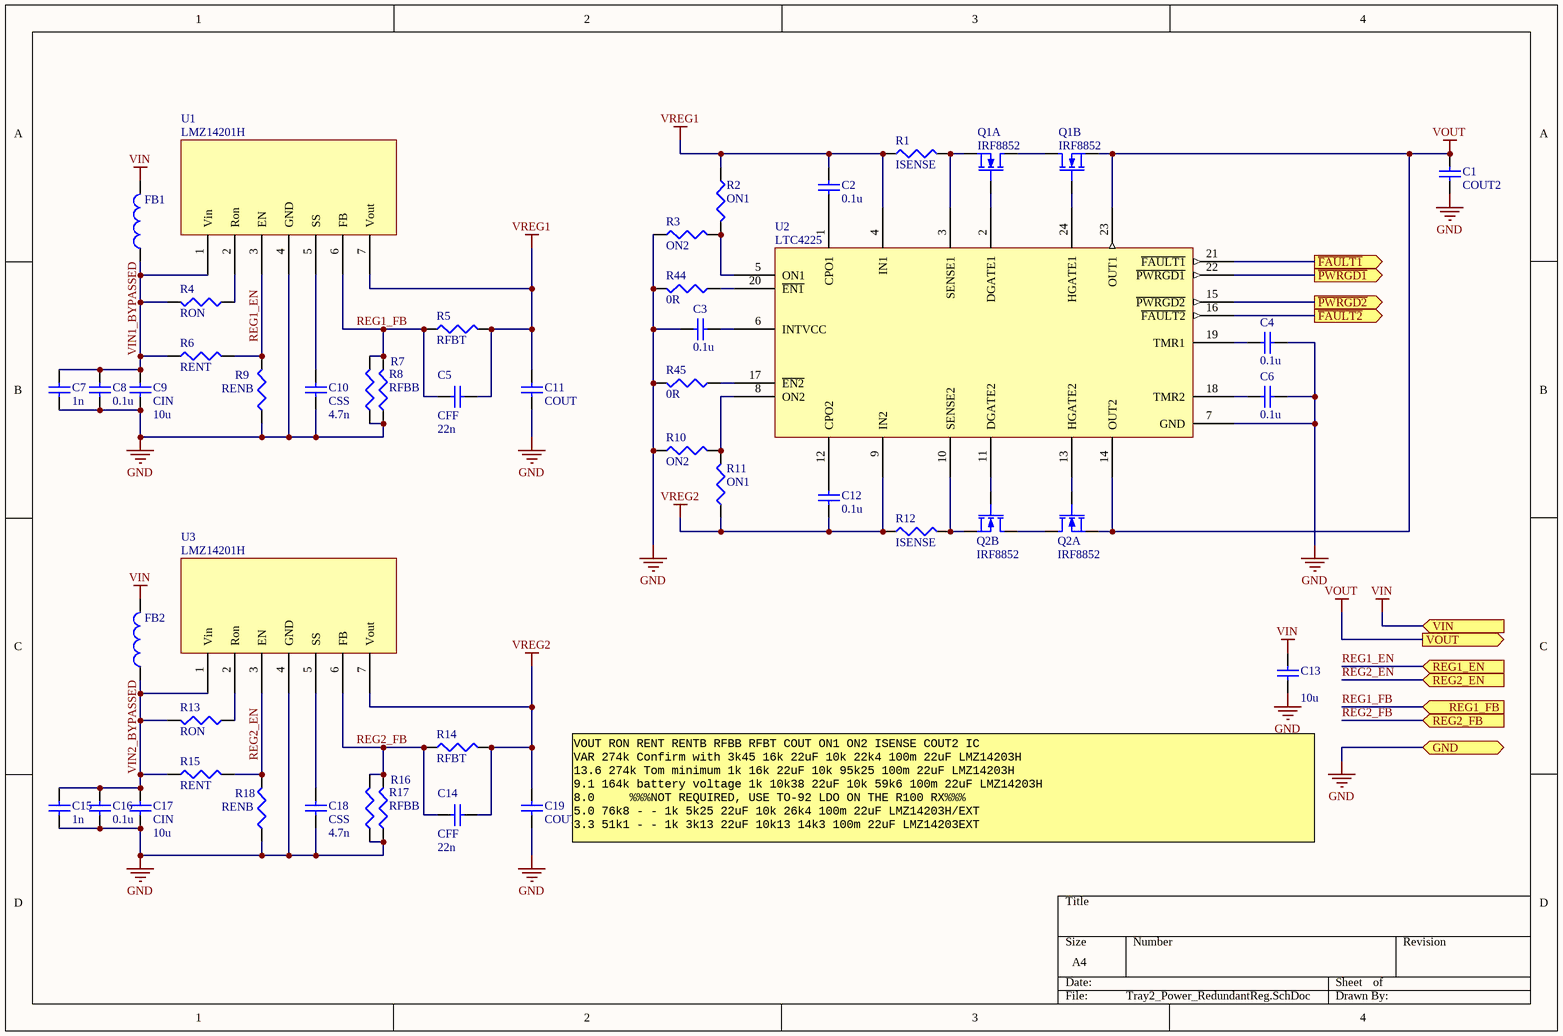
[diagram p3: Tray2_Power_RedundantReg.SchDoc]

### Parts
C1  COUT2  [R1210M]
C2  value 0.1u  [R0805M]
C3  value 0.1u  [R0805M]
C4  value 0.1u  [R0805M]
C5  CFF  value 22n  [R0805M]
C6  value 0.1u  [R0805M]
C7  value 1n  [R0805M]  (hidden comment: CIN)
C8  value 0.1u  [R0805M]  (hidden comment: CIN)
C9  CIN  value 10u  [R1210M]
C10  CSS  value 4.7n  [R0805M]
C11  COUT  [R1210M]
C12  value 0.1u  [R0805M]
C13  value 10u  [R1210M]
C14  CFF  value 22n  [R0805M]
C15  value 1n  [R0805M]  (hidden comment: CIN)
C16  value 0.1u  [R0805M]  (hidden comment: CIN)
C17  CIN  value 10u  [R1210M]
C18  CSS  value 4.7n  [R0805M]
C19  COUT  [R1210M]
FB1  (no value)  [R0805M]
FB2  (no value)  [R0805M]
Q1  IRF8852  [TSSOP8]  (parts A,B of 2)
Q2  IRF8852  [TSSOP8]  (parts A,B of 2)
R1  ISENSE  [R0805M]
R2  ON1  [R0805M]
R3  ON2  [R0805M]
R4  RON  [R0805M]
R5  RFBT  [R0805M]
R6  RENT  [R0805M]
R7  RFBB  [R0805M]  (value not drawn)
R8  RFBB  [R0805M]
R9  RENB  [R0805M]
R10  ON2  [R0805M]
R11  ON1  [R0805M]
R12  ISENSE  [R0805M]
R13  RON  [R0805M]
R14  RFBT  [R0805M]
R15  RENT  [R0805M]
R16  RFBB  [R0805M]  (value not drawn)
R17  RFBB  [R0805M]
R18  RENB  [R0805M]
R44  value 0R  [R0805M]
R45  value 0R  [R0805M]
U1  LMZ14201H  [TO-PMOD-7]
U2  LTC4225  [SSOP24]
U3  LMZ14201H  [TO-PMOD-7]

### Ports
GND, REG1_EN (in), REG1_FB (in), REG2_EN (in), REG2_FB (in), VIN (in), VOUT (out), ~{FAULT1} (out), ~{FAULT2} (out), ~{PWRGD1} (out), ~{PWRGD2} (out)

### Nets
GND: C1.1 C3.2 C4.1 C6.1 C7.1 C8.1 C9.2 C10.2 C11.1 C13.2 C15.1 C16.1 C17.2 C18.2 C19.1 R3.1 R7.1 R8.1 R9.2 R10.1 R16.1 R17.1 R18.2 R44.2 R45.2 U1.4(GND) U2.7(GND) U3.4(GND) ; port GND
VIN: C13.1 FB1.2 FB2.2 ; port VIN
VOUT: C1.2 Q1.S2(S) Q2.S1(S) U2.14(OUT2) U2.23(OUT1) ; port VOUT
VREG1: C2.1 C5.2 C11.2 R1.1 R2.1 R5.2 U1.7(Vout) U2.4(IN1)
VREG2: C12.2 C14.2 C19.2 R11.1 R12.1 R14.2 U2.9(IN2) U3.7(Vout)
~{FAULT1}: U2.21(~{FAULT1}) ; port ~{FAULT1}
~{FAULT2}: U2.16(~{FAULT2}) ; port ~{FAULT2}
~{PWRGD1}: U2.22(~{PWRGD1}) ; port ~{PWRGD1}
~{PWRGD2}: U2.15(~{PWRGD2}) ; port ~{PWRGD2}
REG1_EN: R6.2 R9.1 U1.3(EN) ; port REG1_EN
REG1_FB: C5.1 R5.1 R7.2 R8.2 U1.6(FB) ; port REG1_FB
REG2_EN: R15.2 R18.1 U3.3(EN) ; port REG2_EN
REG2_FB: C14.1 R14.1 R16.2 R17.2 U3.6(FB) ; port REG2_FB
VIN1_BYPASSED: C7.2 C8.2 C9.1 FB1.1 R4.2 R6.1 U1.1(Vin)
VIN2_BYPASSED: C15.2 C16.2 C17.1 FB2.1 R13.2 R15.1 U3.1(Vin)
NetC2_2: C2.2 U2.1(CPO1)
NetC3_1: C3.1 U2.6(INTVCC)
NetC4_2: C4.2 U2.19(TMR1)
NetC6_2: C6.2 U2.18(TMR2)
NetC10_1: C10.1 U1.5(SS)
NetC12_1: C12.1 U2.12(CPO2)
NetC18_1: C18.1 U3.5(SS)
NetQ1_D1: Q1.D1(D) Q1.D2(D)
NetQ1_G1: Q1.G1(G) U2.2(DGATE1)
NetQ1_G2: Q1.G2(G) U2.24(HGATE1)
NetQ1_S1: Q1.S1(S) R1.2 U2.3(SENSE1)
NetQ2_D1: Q2.D1(D) Q2.D2(D)
NetQ2_G1: Q2.G1(G) U2.13(HGATE2)
NetQ2_G2: Q2.G2(G) U2.11(DGATE2)
NetQ2_S2: Q2.S2(S) R12.2 U2.10(SENSE2)
NetR2_2: R2.2 R3.2 U2.5(ON1)
NetR4_1: R4.1 U1.2(Ron)
NetR10_2: R10.2 R11.2 U2.8(ON2)
NetR13_1: R13.1 U3.2(Ron)
NetR44_1: R44.1 U2.20(~{EN1})
NetR45_1: R45.1 U2.17(~{EN2})

### Channels
Regulation/13V6: designators end in .D; ports GND=GND REG1_EN=13V6_EN1 REG1_FB=REG1_FB_13V6 REG2_EN=13V6_EN2 REG2_FB=REG2_FB_13V6 VIN=VBATT VOUT=13V6 ~{FAULT1}=13V6_FAULT1 ~{FAULT2}=13V6_FAULT2 ~{PWRGD1}=13V6_PWRGD1 ~{PWRGD2}=13V6_PWRGD2
Regulation/9V1: designators end in .C; ports GND=GND REG1_EN=9V1_EN1 REG1_FB=REG1_FB_9V1 REG2_EN=9V1_EN2 REG2_FB=REG2_FB_9V1 VIN=VBATT VOUT=9V1 ~{FAULT1}=9V1_FAULT1 ~{FAULT2}=9V1_FAULT2 ~{PWRGD1}=9V1_PWRGD1 ~{PWRGD2}=9V1_PWRGD2
Regulation/5V0: designators end in .B; ports GND=GND REG1_EN=5V0_EN1 REG1_FB=REG1_FB_5V0 REG2_EN=5V0_EN2 REG2_FB=REG2_FB_5V0 VIN=VBATT VOUT=5V0 ~{FAULT1}=5V0_FAULT1 ~{FAULT2}=5V0_FAULT2 ~{PWRGD1}=5V0_PWRGD1 ~{PWRGD2}=5V0_PWRGD2
Regulation/3V3: designators end in .A; ports GND=GND REG1_EN=REG1_EN_3V3 REG1_FB=REG1_FB_3V3 REG2_EN=REG2_EN_3V3 REG2_FB=REG2_FB_3V3 VIN=VBATT VOUT=3V3 ~{FAULT1}=3V3_FAULT1 ~{FAULT2}=3V3_FAULT2 ~{PWRGD1}=3V3_PWRGD1 ~{PWRGD2}=3V3_PWRGD2
Regulation/VVAR: designators end in .E; ports GND=GND REG1_EN=VVAR_EN1 REG1_FB=VVAR_FB1 REG2_EN=VVAR_EN2 REG2_FB=VVAR_FB2 VIN=VBATT VOUT=VVAR ~{FAULT1}=VVAR_FAULT1 ~{FAULT2}=VVAR_FAULT2 ~{PWRGD1}=VVAR_PWRGD1 ~{PWRGD2}=VVAR_PWRGD2

### Notes on the sheet
- VOUT	RON	RENT	RENTB	RFBB	RFBT	COUT	ON1	ON2	ISENSE	COUT2	IC
  VAR	274k	Confirm with	3k45	16k	22uF	10k	22k4	100m	22uF	LMZ14203H
  13.6	274k	Tom minimum	1k	16k	22uF	10k	95k25	100m	22uF	LMZ14203H
  9.1	164k	battery voltage	1k	10k38	22uF	10k	59k6	100m	22uF	LMZ14203H
  8.0     %%%NOT REQUIRED, USE TO-92 LDO ON THE R100 RX%%%
  5.0	76k8	-	-	1k	5k25	22uF	10k	26k4	100m	22uF	LMZ14203H/EXT
  3.3	51k1	-	-	1k	3k13	22uF	10k13	14k3	100m	22uF	LMZ14203EXT

### Library data of the parts
C1 C11 C19 = Cap: Capacitor; Value: 100pF; Published: 8-Jun-2000; LatestRevisionDate: 17-Jul-2002; LatestRevisionNote: Re-released for DXP Platform.; PackageReference: RAD-0.3; Publisher: Altium Limited; PackageDescription: Radial Cap, Thru-Hole; 2 Leads; 0.3 in Pin Spacing
C2-C10 C12-C18 = Cap: Capacitor; Published: 8-Jun-2000; LatestRevisionDate: 17-Jul-2002; LatestRevisionNote: Re-released for DXP Platform.; PackageReference: RAD-0.3; Publisher: Altium Limited; PackageDescription: Radial Cap, Thru-Hole; 2 Leads; 0.3 in Pin Spacing
FB1 FB2 = Inductor: Code_IEC: 1005; Value: 10mH; Published: 8-Jun-2000; LatestRevisionDate: 29-May-2009; LatestRevisionNote: IPC-7351 Footprint Added.; PackageReference: 0402-A; Publisher: Altium Limited; PackageDescription: Chip Inductor; Code_JEITA: 0402
Q1 Q2 = IRF8852: N-Channel MOSFET; Published: 8-Jun-2000; LatestRevisionDate: 17-Jul-2002; LatestRevisionNote: Re-released for DXP Platform.; PackageVersion: 1995/1996; PackageReference: E3; Publisher: Altium Limited; PackageDescription: TO, Flat Index; 3 In-Line, Axial Leads; Body Dia. 4.6mm; Lead Dia. 0.5 mm (max)
R1-R18 = Res3: Resistor; Value: 1K; Published: 8-Jun-2000; LatestRevisionDate: 29-May-2009; LatestRevisionNote: IPC-7351 Footprint Added.; PackageReference: J1-0603; Publisher: Altium Limited; PackageDescription: Chip Resistor
R44 R45 = Res3: Resistor; Published: 8-Jun-2000; LatestRevisionDate: 29-May-2009; LatestRevisionNote: IPC-7351 Footprint Added.; PackageReference: J1-0603; Publisher: Altium Limited; PackageDescription: Chip Resistor
U1 U3 = LMZ14201H: 1A SIMPLE SWITCHER® Power Module for High Output  Voltage
U2 = LTC4225: Dual Ideal Diode and  Hot Swap Controller

## Sheet Tray2_BCR.SchDoc: BLUEsat solar battery charge regulator subystem
size A2; Engineer: Thomas Fisk; Organization: BLUEsat Project; Address1: Room 419; Address2: School of EE&T; Address3: UNSW, NSW 2052; Address4: Australia; DocumentNumber: POWR0008; SheetNumber: 1; SheetTotal: 1; Description: Solar battery charge regulator subsystem.; Version: 2.6; PageSetup: Record=PageOptions|CenterHorizontal=True|CenterVertical=True|PrintScale=0.71|XCorrection=1.00|YCorrection=1.00|PrintKind=1|BorderSize=5000000|LeftOffset=0|BottomOffset=0|Orientation=2|PaperLength=2970|PaperWidth=2100|Scale=100|PaperSource=7|PrintQuality=1200|MediaType=1|DitherType=10|PaperKind=A4|PrintScaleMode=1
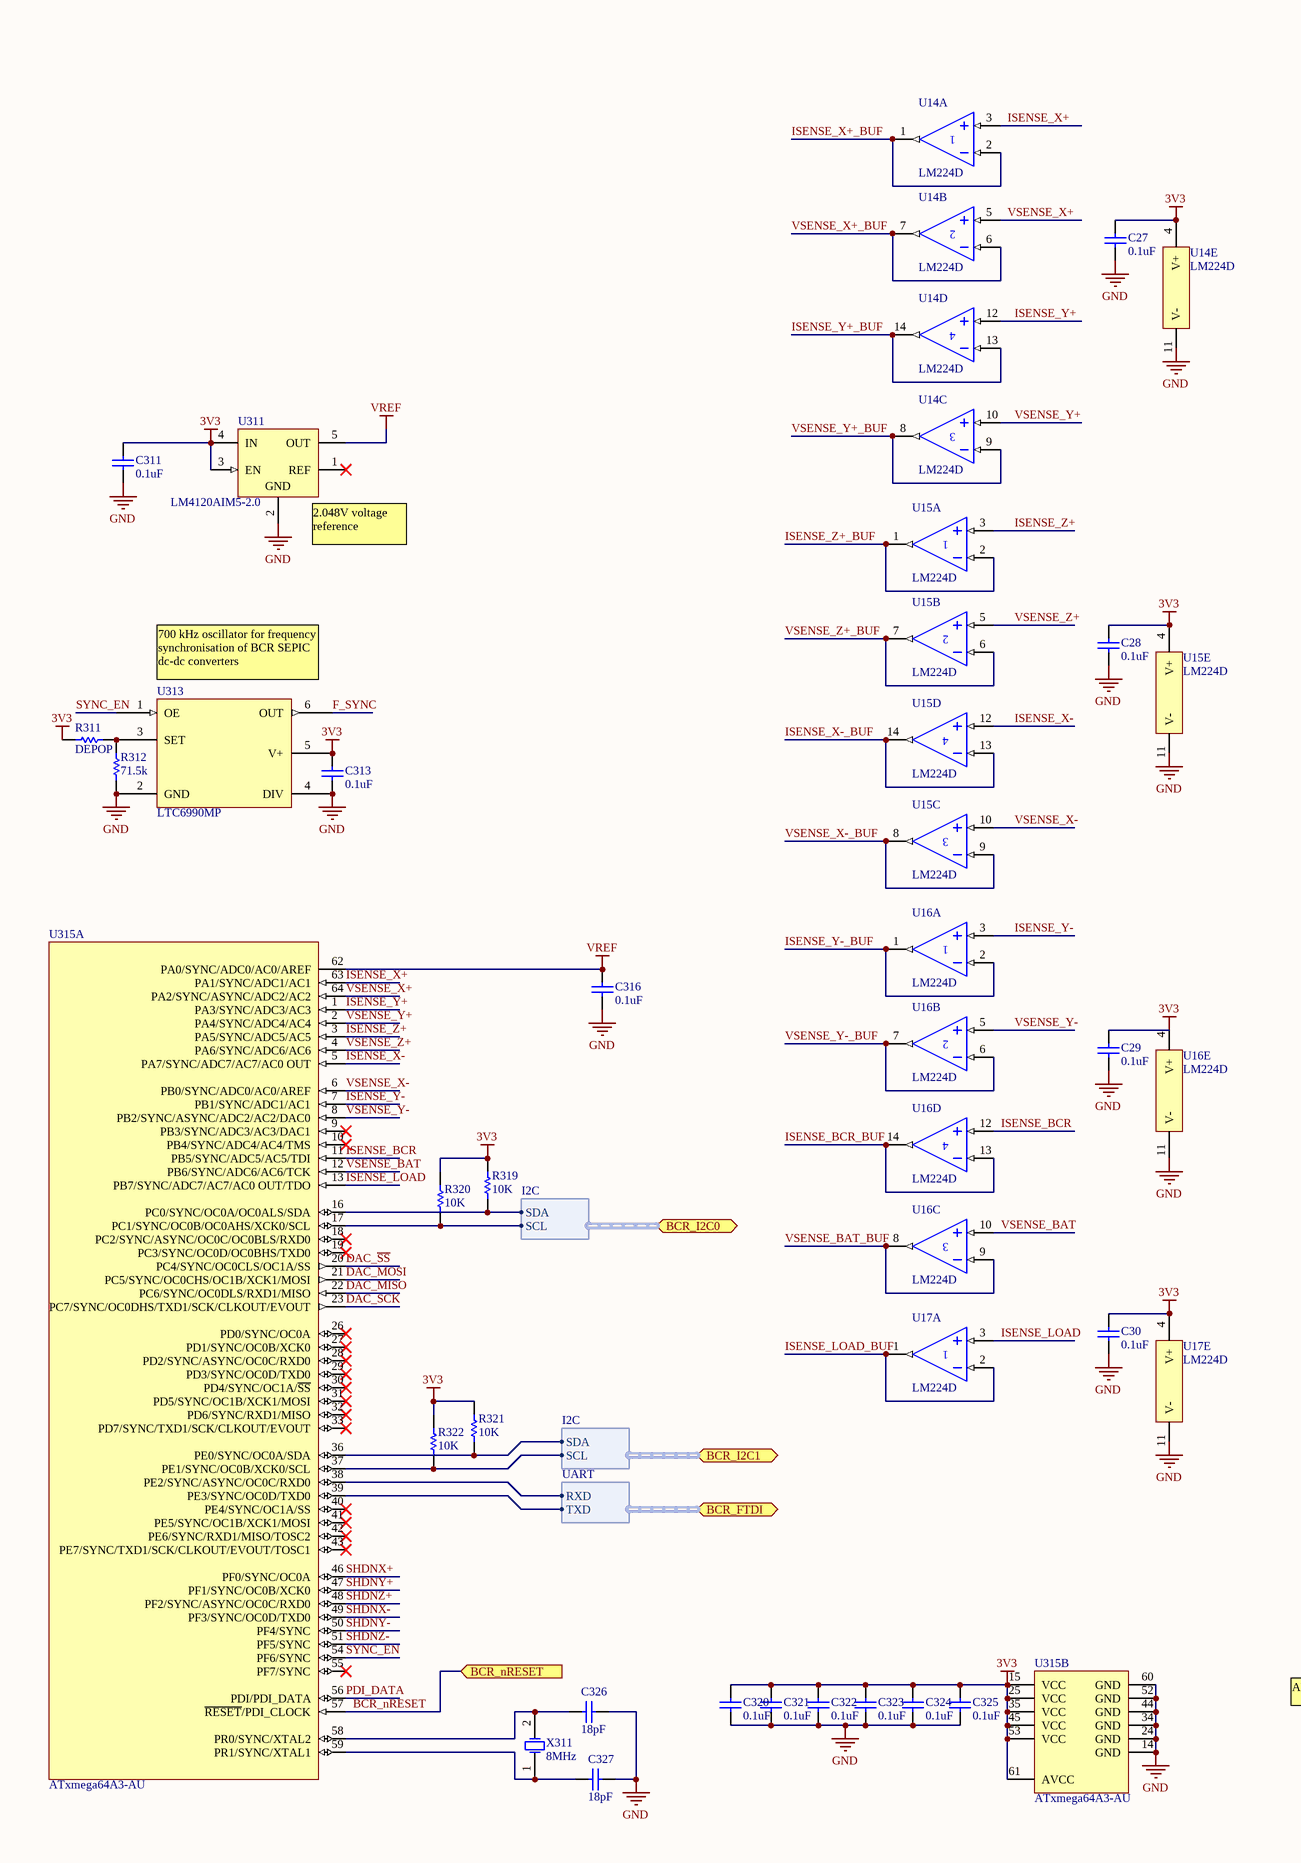
[diagram p4: Tray2_BCR.SchDoc, left]
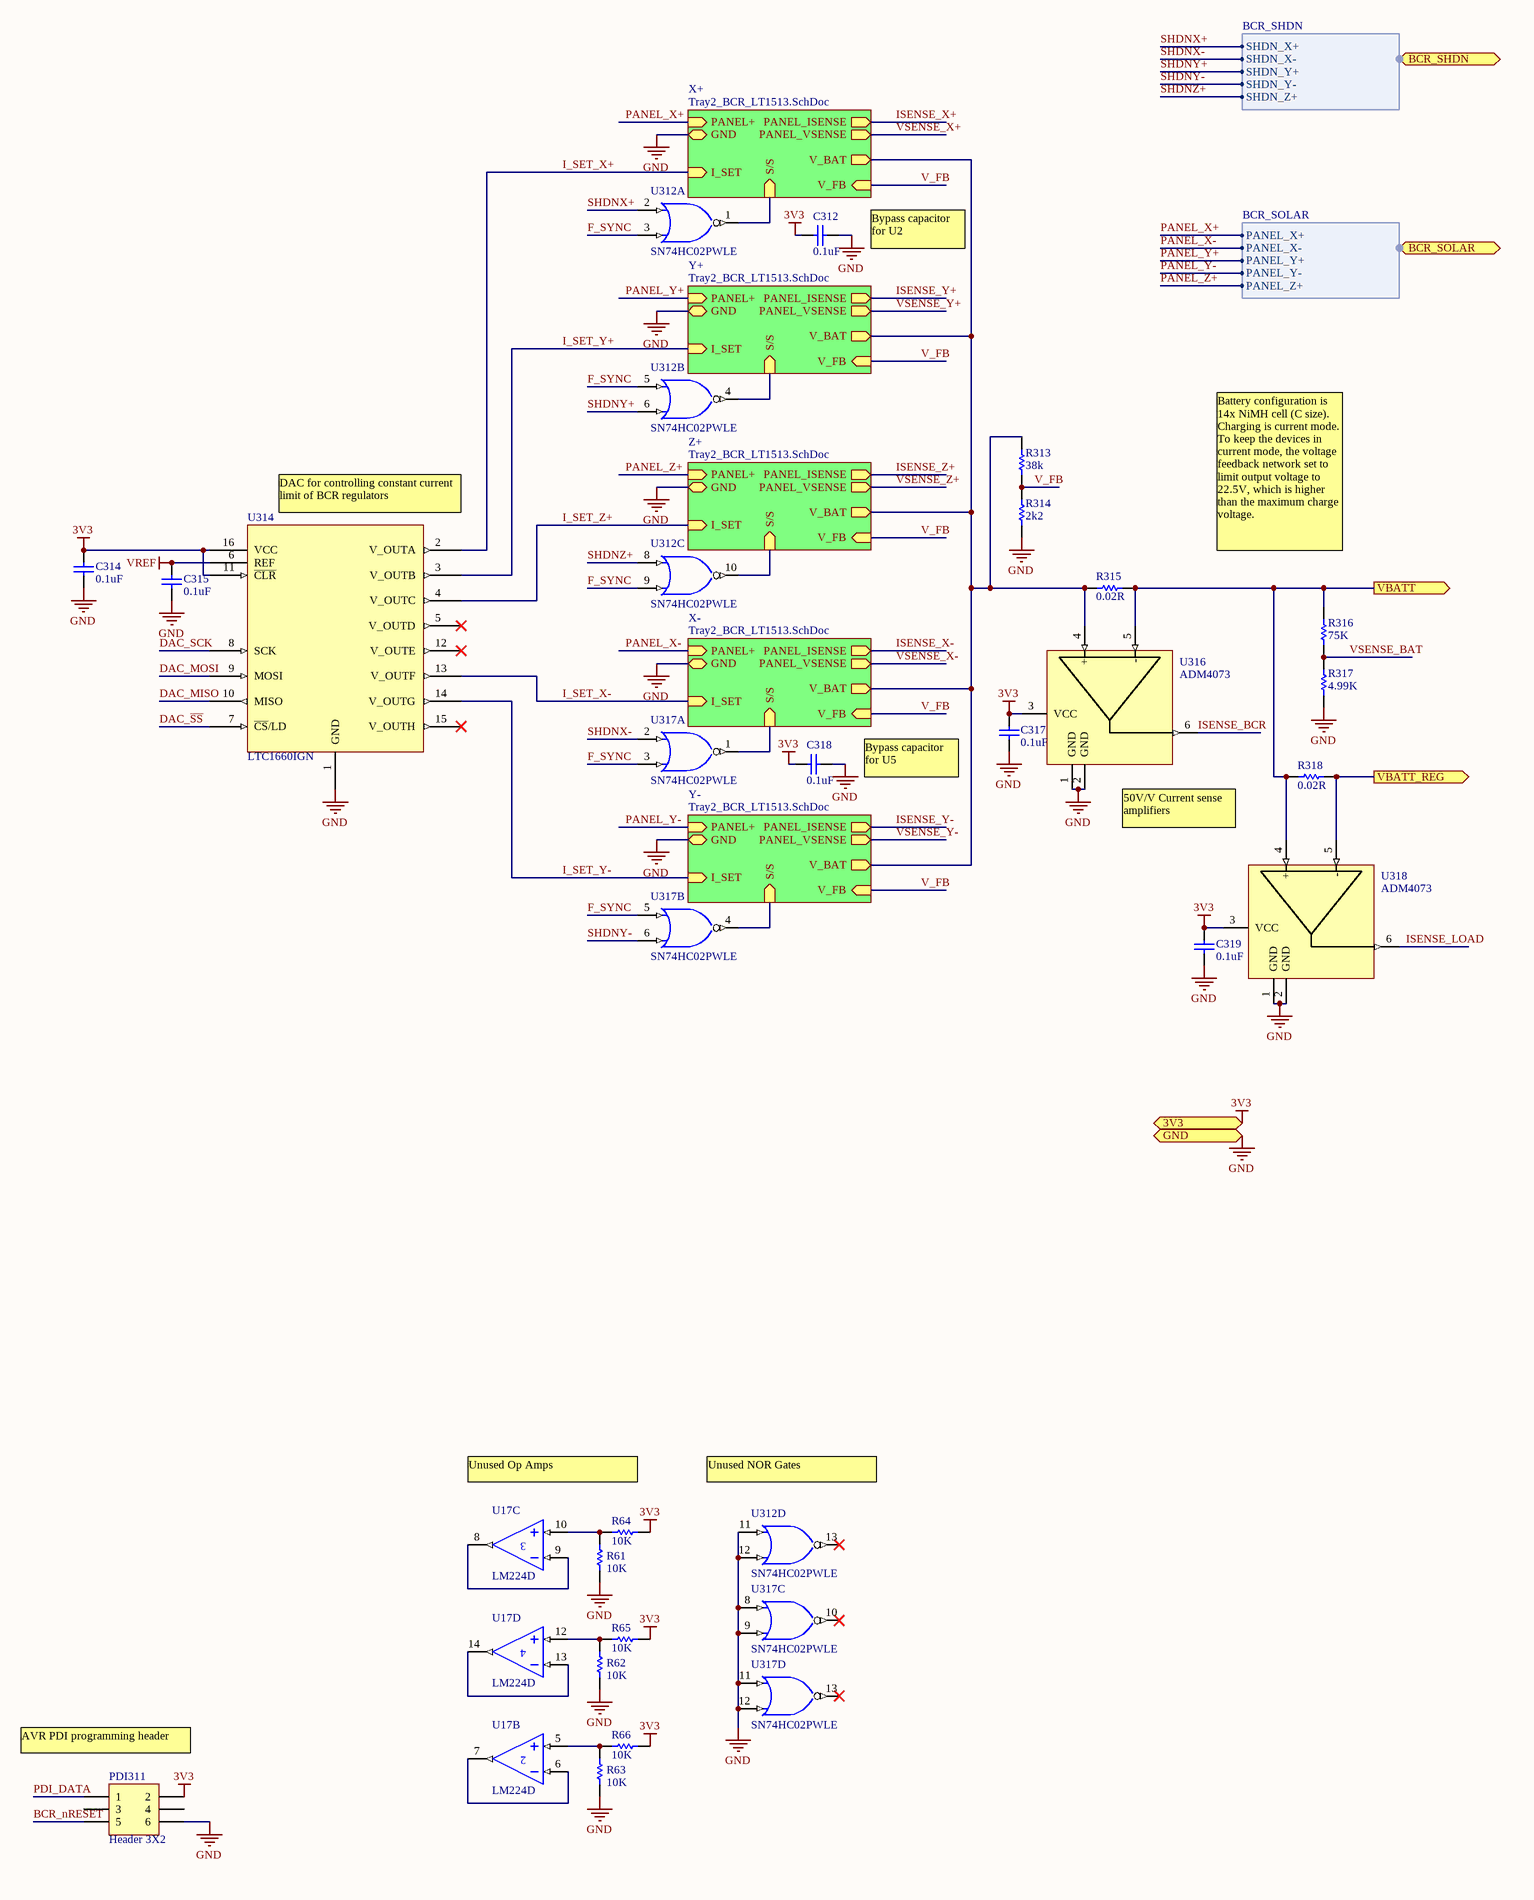
[diagram p5: Tray2_BCR.SchDoc, right]

### Parts
C27  value 0.1uF  [CAPC2012M]  (hidden comment: Cap)
C28  value 0.1uF  [CAPC2012M]  (hidden comment: Cap)
C29  value 0.1uF  [CAPC2012M]  (hidden comment: Cap)
C30  value 0.1uF  [CAPC2012M]  (hidden comment: Cap)
C311  value 0.1uF  [CAPC2012M]  (hidden comment: Cap)
C312  value 0.1uF  [CAPC2012M]  (hidden comment: Cap)
C313  value 0.1uF  [CAPC2012M]  (hidden comment: Cap)
C314  value 0.1uF  [CAPC2012M]  (hidden comment: Cap)
C315  value 0.1uF  [CAPC2012M]  (hidden comment: Cap)
C316  value 0.1uF  [CAPC2012M]  (hidden comment: Cap)
C317  value 0.1uF  [CAPC2012M]  (hidden comment: Cap)
C318  value 0.1uF  [CAPC2012M]  (hidden comment: Cap)
C319  value 0.1uF  [CAPC2012M]  (hidden comment: Cap)
C320  value 0.1uF  [CAPC2012M]  (hidden comment: Cap)
C321  value 0.1uF  [CAPC2012M]  (hidden comment: Cap)
C322  value 0.1uF  [CAPC2012M]  (hidden comment: Cap)
C323  value 0.1uF  [CAPC2012M]  (hidden comment: Cap)
C324  value 0.1uF  [CAPC2012M]  (hidden comment: Cap)
C325  value 0.1uF  [CAPC2012M]  (hidden comment: Cap)
C326  value 18pF  [CAPC2012M]  (hidden comment: Cap)
C327  value 18pF  [CAPC2012M]  (hidden comment: Cap)
PDI311  Header 3X2  [HDR2X3]
R61  value 10K  [RESC2012M]  (hidden comment: Res1)
R62  value 10K  [RESC2012M]  (hidden comment: Res1)
R63  value 10K  [RESC2012M]  (hidden comment: Res1)
R64  value 10K  [RESC2012M]  (hidden comment: Res1)
R65  value 10K  [RESC2012M]  (hidden comment: Res1)
R66  value 10K  [RESC2012M]  (hidden comment: Res1)
R311  value DEPOP  [RESC2012M]  (hidden comment: Res1)
R312  value 71.5k  [RESC2012M]  (hidden comment: Res1)
R313  value 38k  [RESC2012M]  (hidden comment: Res1)
R314  value 2k2  [RESC2012M]  (hidden comment: Res1)
R315  value 0.02R  [RESC2012M]  (hidden comment: 0805 Resistor)
R316  value 75K  [RESC2012M]  (hidden comment: Res1)
R317  value 4.99K  [RESC2012M]  (hidden comment: Res1)
R318  value 0.02R  [RESC2012M]  (hidden comment: 0805 Resistor)
R319  value 10K  [RESC2012M]  (hidden comment: Res1)
R320  value 10K  [RESC2012M]  (hidden comment: Res1)
R321  value 10K  [RESC2012M]  (hidden comment: Res1)
R322  value 10K  [RESC2012M]  (hidden comment: Res1)
U14  LM224D  [D014_N]  (parts A,B,C,D,E of 5)
U15  LM224D  [D014_N]  (parts A,B,C,D,E of 5)
U16  LM224D  [D014_N]  (parts A,B,C,D,E of 5)
U17  LM224D  [D014_N]  (parts A,B,C,D,E of 5)
U311  LM4120AIM5-2.0  [MF05A_N]
U312  SN74HC02PWLE  [TSOP65P640-14AN]  (parts A,B,C,D of 4)
U313  LTC6990MP  [SOT26A-6L]
U314  LTC1660IGN  [SOP635P600-16N]
U315  ATxmega64A3-AU  [64A_N]  (parts A,B of 2)
U316  ADM4073  [SOT26A-6N]
U317  SN74HC02PWLE  [TSOP65P640-14AN]  (parts A,B,C,D of 4)
U318  ADM4073  [SOT26A-6N]
X311  8MHz  [HC49 - No border]

### Sub-sheets
X+ = Tray2_BCR_LT1513.SchDoc: I_SET (in), V_BAT, S/S (in), V_FB (in), PANEL_VSENSE (out), PANEL_ISENSE (out), PANEL+ (in), GND
X- = Tray2_BCR_LT1513.SchDoc: I_SET (in), V_BAT, S/S (in), V_FB (in), PANEL_VSENSE (out), PANEL_ISENSE (out), PANEL+ (in), GND
Y+ = Tray2_BCR_LT1513.SchDoc: I_SET (in), V_BAT, S/S (in), V_FB (in), PANEL_VSENSE (out), PANEL_ISENSE (out), PANEL+ (in), GND
Y- = Tray2_BCR_LT1513.SchDoc: I_SET (in), V_BAT, S/S (in), V_FB (in), PANEL_VSENSE (out), PANEL_ISENSE (out), PANEL+ (in), GND
Z+ = Tray2_BCR_LT1513.SchDoc: I_SET (in), V_BAT, S/S (in), V_FB (in), PANEL_VSENSE (out), PANEL_ISENSE (out), PANEL+ (in), GND

### Ports
3V3, BCR_FTDI (harness UART), BCR_I2C0 (harness I2C), BCR_I2C1 (harness I2C), BCR_nRESET (in), BCR_SHDN (harness BCR_SHDN), BCR_SOLAR (harness BCR_SOLAR), GND, VBATT (out), VBATT_REG (out)

### Harnesses
BCR_SHDN: SHDN_X+, SHDN_X-, SHDN_Y+, SHDN_Y-, SHDN_Z+
I2C: SCL, SDA
UART: RXD, TXD
BCR_SOLAR: PANEL_X+, PANEL_X-, PANEL_Y+, PANEL_Y-, PANEL_Z+

### Nets
3V3: C27.1 C28.1 C29.1 C30.1 C311.2 C312.2 C313.1 C314.2 C317.1 C318.2 C319.1 C320.2 C321.2 C322.2 C323.2 C324.2 C325.2 PDI311.2 R64.2 R65.2 R66.2 R311.1 R319.1 R320.1 R321.1 R322.1 U14.4(V+) U15.4(V+) U17.4(V+) U311.3(EN) U311.4(IN) U313.5(V+) U314.11(~{CLR}) U314.16(VCC) U315.15(VCC) U315.25(VCC) U315.35(VCC) U315.45(VCC) U315.53(VCC) U315.61(AVCC) U316.3(VCC) U318.3(VCC) ; port 3V3
GND: C27.2 C28.2 C29.2 C30.2 C311.1 C312.1 C313.2 C314.1 C315.1 C316.1 C317.2 C318.1 C319.2 C320.1 C321.1 C322.1 C323.1 C324.1 C325.1 C326.2 C327.1 PDI311.6 R61.2 R62.2 R63.2 R312.1 R314.1 R317.2 U16.11(V-) U311.2(GND) U312.7(GND) U312.11(A) U312.12(B) U313.2(GND) U313.4(DIV) U314.1(GND) U315.14(GND) U315.24(GND) U315.34(GND) U315.44(GND) U315.52(GND) U315.60(GND) U316.1(GND) U316.2(GND) U317.7(GND) U317.8(A) U317.9(B) U317.11(A) U317.12(B) U318.1(GND) U318.2(GND) ; port GND, sheet X+/GND, sheet Y+/GND, sheet Z+/GND, sheet X-/GND, sheet Y-/GND
VCC: U312.14(VCC) U317.14(VCC)
VREF: C315.2 C316.2 U311.5(OUT) U314.6(REF) U315.62(PA0/SYNC/ADC0/AC0/AREF)
BCR.FTDI.RXI: U315.39(PE3/SYNC/OC0D/TXD0) ; port BCR_FTDI.TXD
BCR.FTDI.TXO: U315.38(PE2/SYNC/ASYNC/OC0C/RXD0) ; port BCR_FTDI.RXD
BCR_nRESET: PDI311.5 U315.57(~{RESET}/PDI_CLOCK) ; port BCR_nRESET
DAC_MISO: U314.10(MISO) U315.22(PC6/SYNC/OC0DLS/RXD1/MISO)
DAC_MOSI: U314.9(MOSI) U315.21(PC5/SYNC/OC0CHS/OC1B/XCK1/MOSI)
DAC_~{SS}: U314.7(~{CS}/LD) U315.20(PC4/SYNC/OC0CLS/OC1A/SS)
DAC_SCK: U314.8(SCK) U315.23(PC7/SYNC/OC0DHS/TXD1/SCK/CLKOUT/EVOUT)
F_SYNC: U312.3(B) U312.5(A) U312.9(B) U313.6(OUT) U317.3(B) U317.5(A)
I_SET_X+: U314.2(V_OUTA) ; sheet X+/I_SET
I_SET_X-: U314.13(V_OUTF) ; sheet X-/I_SET
I_SET_Y+: U314.3(V_OUTB) ; sheet Y+/I_SET
I_SET_Y-: U314.14(V_OUTG) ; sheet Y-/I_SET
I_SET_Z+: U314.4(V_OUTC) ; sheet Z+/I_SET
ISENSE_BCR: U16.12(IN+) U315.11(PB5/SYNC/ADC5/AC5/TDI) U316.6
ISENSE_BCR_BUF: U16.13(IN-) U16.14(OUT)
ISENSE_LOAD: U17.3(IN+) U315.13(PB7/SYNC/ADC7/AC7/AC0_OUT/TDO) U318.6
ISENSE_LOAD_BUF: U17.1(OUT) U17.2(IN-)
ISENSE_X+: U14.3(IN+) U315.63(PA1/SYNC/ADC1/AC1) ; sheet X+/PANEL_ISENSE
ISENSE_X+_BUF: U14.1(OUT) U14.2(IN-)
ISENSE_X-: U15.12(IN+) U315.5(PA7/SYNC/ADC7/AC7/AC0_OUT) ; sheet X-/PANEL_ISENSE
ISENSE_X-_BUF: U15.13(IN-) U15.14(OUT)
ISENSE_Y+: U14.12(IN+) U315.1(PA3/SYNC/ADC3/AC3) ; sheet Y+/PANEL_ISENSE
ISENSE_Y+_BUF: U14.13(IN-) U14.14(OUT)
ISENSE_Y-: U16.3(IN+) U315.7(PB1/SYNC/ADC1/AC1) ; sheet Y-/PANEL_ISENSE
ISENSE_Y-_BUF: U16.1(OUT) U16.2(IN-)
ISENSE_Z+: U15.3(IN+) U315.3(PA5/SYNC/ADC5/AC5) ; sheet Z+/PANEL_ISENSE
ISENSE_Z+_BUF: U15.1(OUT) U15.2(IN-)
PANEL_X+: sheet X+/PANEL+, port BCR_SOLAR.PANEL_X+
PANEL_X-: sheet X-/PANEL+, port BCR_SOLAR.PANEL_X-
PANEL_Y+: sheet Y+/PANEL+, port BCR_SOLAR.PANEL_Y+
PANEL_Y-: sheet Y-/PANEL+, port BCR_SOLAR.PANEL_Y-
PANEL_Z+: sheet Z+/PANEL+, port BCR_SOLAR.PANEL_Z+
PDI_DATA: PDI311.1 U315.56(PDI/PDI_DATA)
SCL: R320.2 U315.17(PC1/SYNC/OC0B/OC0AHS/XCK0/SCL) ; port BCR_I2C0.SCL
SDA: R319.2 U315.16(PC0/SYNC/OC0A/OC0ALS/SDA) ; port BCR_I2C0.SDA
SHDNX+: U312.2(A) U315.46(PF0/SYNC/OC0A) ; port BCR_SHDN.SHDN_X+
SHDNX-: U315.49(PF3/SYNC/OC0D/TXD0) U317.2(A) ; port BCR_SHDN.SHDN_X-
SHDNY+: U312.6(B) U315.47(PF1/SYNC/OC0B/XCK0) ; port BCR_SHDN.SHDN_Y+
SHDNY-: U315.50(PF4/SYNC) U317.6(B) ; port BCR_SHDN.SHDN_Y-
SHDNZ+: U312.8(A) U315.48(PF2/SYNC/ASYNC/OC0C/RXD0) ; port BCR_SHDN.SHDN_Z+
SHDNZ-: U315.51(PF5/SYNC)
SYNC_EN: U313.1(OE) U315.54(PF6/SYNC)
V_FB: R313.1 R314.2 ; sheet X+/V_FB, sheet Y+/V_FB, sheet Z+/V_FB, sheet X-/V_FB, sheet Y-/V_FB
VSENSE_BAT: R316.2 R317.1 U16.10(IN+) U315.12(PB6/SYNC/ADC6/AC6/TCK)
VSENSE_BAT_BUF: U16.8(OUT) U16.9(IN-)
VSENSE_X+: U14.5(IN+) U315.64(PA2/SYNC/ASYNC/ADC2/AC2) ; sheet X+/PANEL_VSENSE
VSENSE_X+_BUF: U14.6(IN-) U14.7(OUT)
VSENSE_X-: U15.10(IN+) U315.6(PB0/SYNC/ADC0/AC0/AREF) ; sheet X-/PANEL_VSENSE
VSENSE_X-_BUF: U15.8(OUT) U15.9(IN-)
VSENSE_Y+: U14.10(IN+) U315.2(PA4/SYNC/ADC4/AC4) ; sheet Y+/PANEL_VSENSE
VSENSE_Y+_BUF: U14.8(OUT) U14.9(IN-)
VSENSE_Y-: U16.5(IN+) U315.8(PB2/SYNC/ASYNC/ADC2/AC2/DAC0) ; sheet Y-/PANEL_VSENSE
VSENSE_Y-_BUF: U16.6(IN-) U16.7(OUT)
VSENSE_Z+: U15.5(IN+) U315.4(PA6/SYNC/ADC6/AC6) ; sheet Z+/PANEL_VSENSE
VSENSE_Z+_BUF: U15.6(IN-) U15.7(OUT)
NetC306.A_1: R313.2 R315.1 U316.4(+) ; sheet X+/V_BAT, sheet Y+/V_BAT, sheet Z+/V_BAT, sheet X-/V_BAT, sheet Y-/V_BAT
NetC326_1: C326.1 U315.58(PR0/SYNC/XTAL2) X311.2(OSC2)
NetC327_2: C327.2 U315.59(PR1/SYNC/XTAL1) X311.1(OSC1)
NetR61_1: R61.1 R64.1 U17.10(IN+)
NetR62_1: R62.1 R65.1 U17.12(IN+)
NetR63_1: R63.1 R66.1 U17.5(IN+)
NetR311_2: R311.2 R312.2 U313.3(SET)
NetR315_2: R315.2 R316.1 R318.2 U316.5(-) U318.4(+) ; port VBATT
NetR318_1: R318.1 U318.5(-) ; port VBATT_REG
NetR321_2: R321.2 U315.36(PE0/SYNC/OC0A/SDA) ; port BCR_I2C1.SDA
NetR322_2: R322.2 U315.37(PE1/SYNC/OC0B/XCK0/SCL) ; port BCR_I2C1.SCL
NetU17_6: U17.6(IN-) U17.7(OUT)
NetU17_8: U17.8(OUT) U17.9(IN-)
NetU17_13: U17.13(IN-) U17.14(OUT)
NetU302.A_6: U312.1(Y) ; sheet X+/S/S
NetU302.B_6: U312.4(Y) ; sheet Y+/S/S
NetU302.C_6: U312.10(Y) ; sheet Z+/S/S
NetU302.D_6: U317.1(Y) ; sheet X-/S/S
NetU302.E_6: U317.4(Y) ; sheet Y-/S/S

Not connected (* = marked no-connect by the designer): PDI311 3 4; U14 11(V-); U15 11(V-); U16 4(V+); U17 11(V-); U311 1(REF)*; U312 13(Y)*; U314 5(V_OUTD)* 12(V_OUTE)* 15(V_OUTH)*; U315 9(PB3/SYNC/ADC3/AC3/DAC1)* 10(PB4/SYNC/ADC4/AC4/TMS)* 18(PC2/SYNC/ASYNC/OC0C/OC0BLS/RXD0)* 19(PC3/SYNC/OC0D/OC0BHS/TXD0)* 26(PD0/SYNC/OC0A)* 27(PD1/SYNC/OC0B/XCK0)* 28(PD2/SYNC/ASYNC/OC0C/RXD0)* 29(PD3/SYNC/OC0D/TXD0)* 30(PD4/SYNC/OC1A/~{SS})* 31(PD5/SYNC/OC1B/XCK1/MOSI)* 32(PD6/SYNC/RXD1/MISO)* 33(PD7/SYNC/TXD1/SCK/CLKOUT/EVOUT)* 40(PE4/SYNC/OC1A/SS)* 41(PE5/SYNC/OC1B/XCK1/MOSI)* 42(PE6/SYNC/RXD1/MISO/TOSC2)* 43(PE7/SYNC/TXD1/SCK/CLKOUT/EVOUT/TOSC1)* 55(PF7/SYNC)*; U317 10(Y)* 13(Y)*

### Notes on the sheet
- (near C312) Bypass capacitor for U2
- (near U314) DAC for controlling constant current limit of BCR regulators
- Battery configuration is 14x NiMH cell (C size). Charging is current mode. To keep the devices in current mode, the voltage feedback network set to limit output voltage to 22.5V, which is higher than the maximum charge voltage.
- (near U311) 2.048V voltage reference
- (near U313) 700 kHz oscillator for frequency synchronisation of BCR SEPIC dc-dc converters
- Bypass capacitor for U5
- 50V/V Current sense amplifiers
- Unused Op Amps
- Unused NOR Gates
- (near PDI311) AVR PDI programming header
- Labels drawn without touching a wire or pin: GND
- Title
- Size:
- Date:
- File:
- A2
- Number:
- Time:
- Revision:
- Sheet
- of

### Library data of the parts
C27-C30 C311-C327 = Cap: Capacitor; Published: 8-Jun-2000; LatestRevisionDate: 17-Jul-2002; LatestRevisionNote: Re-released for DXP Platform.; PackageReference: RAD-0.3; Publisher: Altium Limited; PackageDescription: Radial Cap, Thru-Hole; 2 Leads; 0.3 in Pin Spacing; Supplier 1: Farnell; Supplier 2: Farnell; Supplier Part Number 2: 1759265
PDI311 = Header 3X2: Header, 3-Pin, Dual row; LatestRevisionDate: 17-Jul-2002; LatestRevisionNote: Re-released for DXP Platform.; Publisher: Altium Limited
R61-R66 R311-R322 = Res1: Resistor; Published: 8-Jun-2000; LatestRevisionDate: 17-Jul-2002; LatestRevisionNote: Re-released for DXP Platform.; PackageReference: AXIAL-0.3; Publisher: Altium Limited; PackageDescription: Axial Device, Thru-Hole; 2 Leads; 0.3 in Pin Spacing; Supplier 1: Farnell
U14-U17 = LM224D: Quadruple Operational Amplifier; Published: 15-Apr-2002; LatestRevisionDate: 13-Apr-2006; LatestRevisionNote: IPC-7351 Footprint Added.; DatasheetVersion: Jan-1989; PackageVersion: Jan-1998; PackageReference: D014; Publisher: Altium Limited; PackageDescription: 14-Pin Small Outline Integrated Circuit 1.27 mm Pitch; Code_IPC: SOIC127P600-14; ComponentLink1Description: Manufacturer Link; ComponentLink1URL: http://www.ti.com/; ComponentLink2Description: Datasheet; ComponentLink2URL: http://www-s.ti.com/sc/ds/lm224.pdf
U311 = LM4120AIM5-2.0: Precision Micropower Low Dropout Voltage Reference; Manufacturer: National Semiconductor; CompType: Voltage Reference IC; PackageTopMarking: R14A*XTT; PowerWise: Y; Published: 4-Dec-2008; DatasheetVersion: Mar-2005; PackageVersion: revD, Aug-2008; PackageReference: MF05A; Publisher: Altium Limited; PackageDescription: Molded SOT-23, .115 x .063 x .040 in Body, 5 Lead, .0375 in Pitch; PartNumber: LM4120AIM5-2.0; RoHS: O; PinCount: 5; DigiKeyPartNumber: LM4120AIM5-2.0CT-ND; ComponentLink1Description: LM4120 Datasheet; ComponentLink1URL: http://www.national.com/ds/LM/LM4120.pdf; ComponentLink2Description: LM4120 Web Page; ComponentLink2URL: http://www.national.com/pf/LM/LM4120.html; ComponentLink3Description: MF05A Package Page; ComponentLink3URL: http://www.national.com/packaging/folders/mf05a.html
U312 U317 = SN74HC02PWLE: Quadruple 2-Input Positive-NOR Gate; Published: 8-Jun-2000; LatestRevisionDate: 04-Mar-2005; LatestRevisionNote: Stylized 3D Model Added.; DatasheetVersion: May-1997; PackageVersion: Feb-1999; PackageReference: PW014; Publisher: Altium Limited; PackageDescription: Shrink Small Outline; 14 Leads; Body Width 4.4 mm; Pitch 0.65 mm; ComponentLink1Description: Manufacturer Link; ComponentLink1URL: http://www.ti.com/; ComponentLink2Description: Datasheet; ComponentLink2URL: http://www-s.ti.com/sc/ds/sn74hc02.pdf
U315 = ATxmega64A3-AU: 8/16-bit AVR XMEGA A3 Microcontroller, 1.6-3.6V, 32MHz, 64KB + 4KB Flash, 2KB EEPROM, 4KB SRAM, 64-pin TQFP, Industrial Grade (-40°C to 85°C), Pb-Free; DatasheetVersion: revT, Dec-2010; PackageVersion: revC, Oct-2010; PackageReference: 64A; PackageDescription: 64-Pin Plastic Thin Profile Quad Flat Pack, 14 x 14 x 1.0 mm Body, 0.8 mm Pitch (TQFP); Code_JEDEC: MS-026-AEB; ComponentLink1Description: Manufacturer URL; ComponentLink1URL: http://www.atmel.com/; ComponentLink2Description: ATxmega64A3/128A3/192A3/256A3 Datasheet; ComponentLink2URL: http://www.atmel.com/dyn/resources/prod_documents/doc8068.pdf
U316 U318 = ADM4073: Current Sense Amplifer
X311 = XTAL: Crystal Oscillator; Published: 8-Jun-2000; LatestRevisionDate: 17-Jul-2002; LatestRevisionNote: Re-released for DXP Platform.; PackageReference: R38; Publisher: Altium Limited; PackageDescription: Crystal, Thru-Hole; 2 Leads; Body 3.1 x 8.2 mm (Dia.xH)